# EAGLE design SparkFun_Thing_Plus_NORA_W306 (EAGLE 9.6.2)
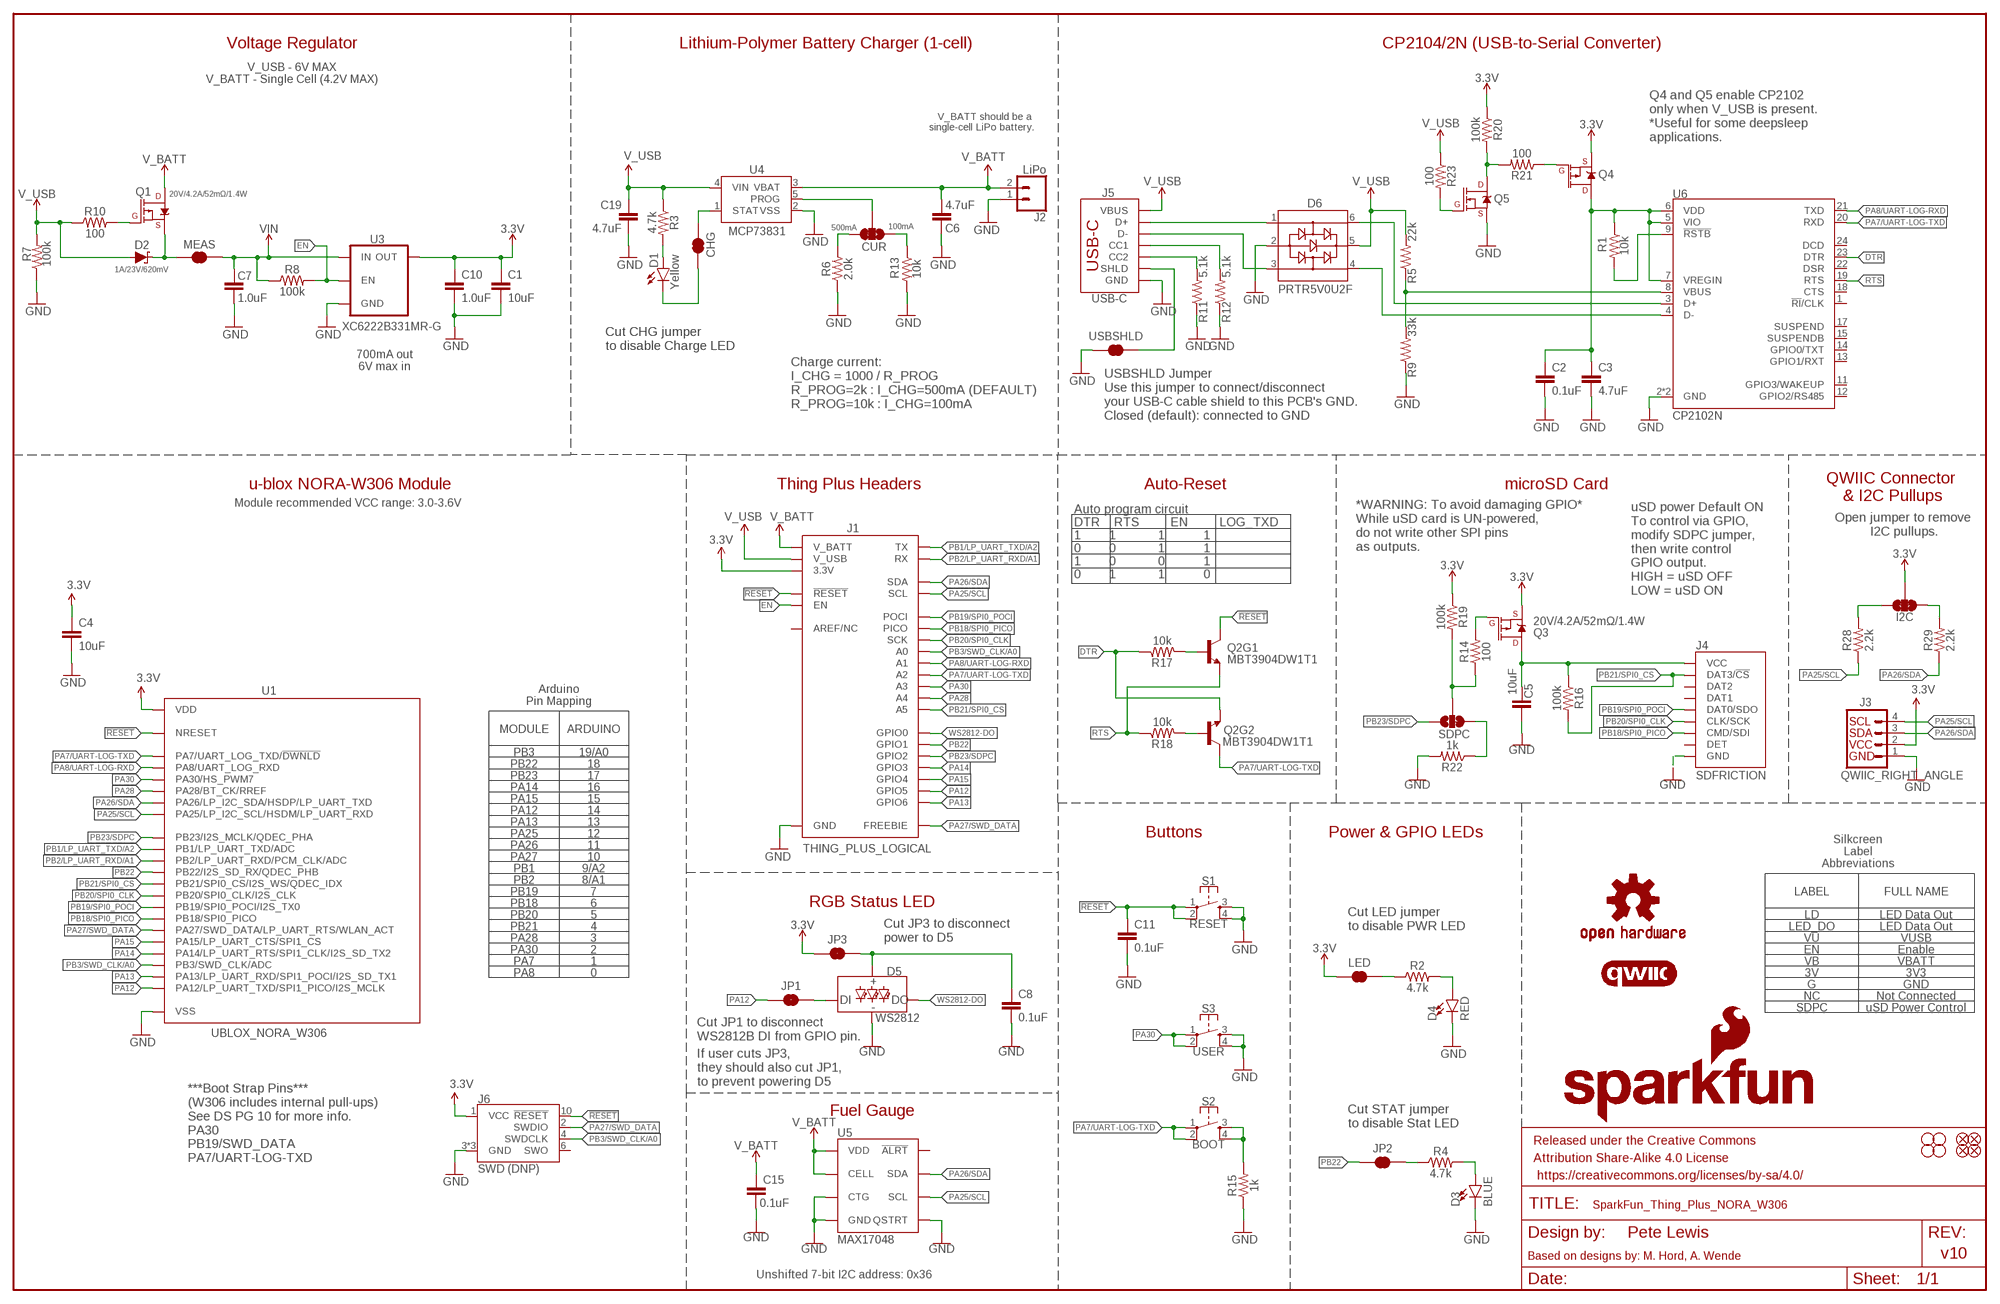
[diagram p0: schematic, sheet 1]

## Parts
C1  10uF  10UF-0402T-6.3V-20%  [0402-TIGHT]
C2  0.1uF  0.1UF-0402T-16V-10%  [0402-TIGHT]
C3  4.7uF  4.7UF-0603-35V-(20%)  [0603]
C4  10uF  10UF-0402T-6.3V-20%  [0402-TIGHT]
C5  10uF  10UF-0402T-6.3V-20%  [0402-TIGHT]
C6  4.7uF  4.7UF-0603-35V-(20%)  [0603]
C7  1.0uF  1.0UF-0402T-16V-10%  [0402-TIGHT]
C8  0.1uF  0.1UF-0402T-16V-10%  [0402-TIGHT]
C10  1.0uF  1.0UF-0402T-16V-10%  [0402-TIGHT]
C11  0.1uF  0.1UF-0402T-16V-10%  [0402-TIGHT]
C15  0.1uF  0.1UF-0402T-16V-10%  [0402-TIGHT]
C19  4.7uF  4.7UF-0603-35V-(20%)  [0603]
CHG  JUMPER-SMT_2_NC_TRACE_SILK  [SMT-JUMPER_2_NC_TRACE_SILK]
CUR  JUMPER-SMT_3_1-NC_TRACE_SILK  [SMT-JUMPER_3_1-NC_TRACE_SILK]
D1  Yellow  LED-YELLOW0603  [LED-0603]
D2  1A/23V/620mV  DIODE-SCHOTTKY-BAT20J  [SOD-323]
D3  BLUE  LED-BLUE0603  [LED-0603]
D4  RED  LED-RED_0603-KB  [LED-0603]
D5  WS2812  WS2812_2020  [WS2812-2020]
D6  PRTR5V0U2F  [SOT886]
FD1  FIDUCIALUFIDUCIAL  [FIDUCIAL-MICRO]
FD2  FIDUCIALUFIDUCIAL  [FIDUCIAL-MICRO]
FD3  FIDUCIALUFIDUCIAL  [FIDUCIAL-MICRO]
FD4  FIDUCIALUFIDUCIAL  [FIDUCIAL-MICRO]
FRAME1  FRAME-LEDGER  [CREATIVE_COMMONS]
H1  STAND-OFF  [STAND-OFF]
H2  STAND-OFF  [STAND-OFF]
H3  STAND-OFF  [STAND-OFF]
H4  STAND-OFF  [STAND-OFF]
I2C  JUMPER-SMT_3_2-NC_TRACE_SILK  [SMT-JUMPER_3_2-NC_TRACE_SILK]
J1  THING_PLUS_LOGICAL  [THING_PLUS]
J2  LiPo  CONN_02-JST-2MM-SMT  [JST-2-SMD]
J3  QWIIC_RIGHT_ANGLE  QWIIC_CONNECTORJS-1MM  [JST04_1MM_RA]
J4  SDFRICTION  MICRO-SDFRICTION  [MICROSD_TINY]
J5  USB-C  USB_C_4-LAYER-ISOLATED  [USB-C-16P-4LAYER-ISOLATED]
J6  SWD (DNP)  CORTEX_JTAG_DEBUG_MINIMUM_SMD_UNSHROUDED_DNP_NO_PASTE  [2X5-SMD-UNSHROUDED_DNP_NO_PASTE]
JP1  JUMPER-SMT_2_NC_TRACE_SILK  [SMT-JUMPER_2_NC_TRACE_SILK]
JP2  JUMPER-SMT_2_NC_TRACE_SILK  [SMT-JUMPER_2_NC_TRACE_SILK]
JP3  JUMPER-SMT_2_NC_TRACE_SILK  [SMT-JUMPER_2_NC_TRACE_SILK]
LED  JUMPER-SMT_2_NC_TRACE_SILK  [SMT-JUMPER_2_NC_TRACE_SILK]
LOGO2  OSHW-LOGOM  [OSHW-LOGO-M]
LOGO3  SFE_LOGO_NAME_FLAME.1_INCH  [SFE_LOGO_NAME_FLAME_.1]
LOGO6  QWIIC_LOGO_4MM  [QWIIC_4MM]
MEAS  JUMPER-COMBO_2_NC_TRACE  [COMBO-JUMPER_2_NC_TRACE]
Q1  20V/4.2A/52mΩ/1.4W  MOSFET_PCH-DMG2305UX-7  [SOT23-3]
Q2  MBT3904DW1T1  TRANS_NPN_DUAL-MBT3904DW1T1  [SC70-6]
Q3  20V/4.2A/52mΩ/1.4W  MOSFET_PCH-DMG2305UX-7  [SOT23-3]
Q4  20V/4.2A/52mΩ/1.4W  MOSFET_PCH-DMG2305UX-7  [SOT23-3]
Q5  20V/0.2A/8MHz/1.2Ω/1Vth  MOSFET-NCH-RE1C002UNTCL  [SOT-416FL]
R1  10k  10KOHM-0402T-1/16W-1%  [0402-TIGHT]
R2  4.7k  4.7KOHM-0402T-1/16W-1%  [0402-TIGHT]
R3  4.7k  4.7KOHM-0402T-1/16W-1%  [0402-TIGHT]
R4  4.7k  4.7KOHM-0402T-1/16W-1%  [0402-TIGHT]
R5  22k  22KOHM-0402_TIGHT-1/10W-1%  [0402-TIGHT]
R6  2.0k  2.0KOHM-0603-1/10W-5%  [0603]
R7  100k  100KOHM-0402T-1/16W-1%  [0402-TIGHT]
R8  100k  100KOHM-0402T-1/16W-1%  [0402-TIGHT]
R9  33k  33KOHM-0402T-1/16W-1%  [0402-TIGHT]
R10  100  100OHM-0402-TIGHT-1/16W-1%  [0402-TIGHT]
R11  5.1k  5.1KOHM-0402T-1/16W-1%  [0402-TIGHT]
R12  5.1k  5.1KOHM-0402T-1/16W-1%  [0402-TIGHT]
R13  10k  10KOHM-0402T-1/16W-1%  [0402-TIGHT]
R14  100  100OHM-0402-TIGHT-1/16W-1%  [0402-TIGHT]
R15  1k  1KOHM-0402T-1/16W-1%  [0402-TIGHT]
R16  100k  100KOHM-0402T-1/16W-1%  [0402-TIGHT]
R17  10k  10KOHM-0402T-1/16W-1%  [0402-TIGHT]
R18  10k  10KOHM-0402T-1/16W-1%  [0402-TIGHT]
R19  100k  100KOHM-0402T-1/16W-1%  [0402-TIGHT]
R20  100k  100KOHM-0402T-1/16W-1%  [0402-TIGHT]
R21  100  100OHM-0402-TIGHT-1/16W-1%  [0402-TIGHT]
R22  1k  1KOHM-0402T-1/16W-1%  [0402-TIGHT]
R23  100  100OHM-0402-TIGHT-1/16W-1%  [0402-TIGHT]
R28  2.2k  2.2KOHM-0402T-1/16W-1%  [0402-TIGHT]
R29  2.2k  2.2KOHM-0402T-1/16W-1%  [0402-TIGHT]
S1  RESET  MOMENTARY-SWITCH-SPST-2-SMD-4.6X2.8MM  [TACTILE_SWITCH_SMD_4.6X2.8MM]
S2  BOOT  MOMENTARY-SWITCH-SPST-2-SMD-4.6X2.8MM  [TACTILE_SWITCH_SMD_4.6X2.8MM]
S3  USER  MOMENTARY-SWITCH-SPST-2-SMD-4.6X2.8MM  [TACTILE_SWITCH_SMD_4.6X2.8MM]
SDPC  JUMPER-SMT_3_1-NC_TRACE_SILK  [SMT-JUMPER_3_1-NC_TRACE_SILK]
U1  UBLOX_NORA_W306  [UBLOX-NORA-W3]
U3  XC6222B331MR-G  [SOT23-5]
U4  MCP73831  [SOT23-5]
U5  MAX17048  MAX17048DFN8  [DFN-8]
U6  CP2102N  [QFN24]
USBSHLD  JUMPER-SMT_2_NC_TRACE_SILK  [SMT-JUMPER_2_NC_TRACE_SILK]

## Nets
3.3V: C1.1 C4.1 C10.1 I2C.2 J1.27(3.3V) J3.2 J6.1(VCC) JP3.1 LED.1 Q3.2(S) Q4.2(S) R19.1 R20.1 U1.A7(VDD) U1.A8(VDD) U1.B7(VDD) U3.5(OUT)
!RESET!: C11.1 J1.28(!RESET) J6.10(!RESET) Q2.3(C) S1.1 S1.2 U1.J3(NRESET)
CC1: J5.A5(CC1) R12.2
CC2: J5.B5(CC2) R11.2
CHG: CHG.2 U4.1(STAT)
DTR: Q2.1(E) R17.1 U6.23(DTR)
EN: J1.11(EN) R8.2 U3.3(EN)
GND: C1.2 C2.2 C3.2 C4.2 C5.2 C6.2 C7.2 C8.2 C10.2 C11.2 C15.2 C19.2 D3.C D4.C D5.GND D6.2 J1.25(GND) J2.1 J3.1 J4.6(GND) J4.GND1(GND) J4.GND2(GND) J4.GND3(GND) J4.GND4(GND) J4.GND5(GND) J4.GND6(GND) J5.GND J5.GND2(GND) J6.3(GND) J6.5(GND) J6.9(GND) Q5.2(S) R6.1 R7.1 R9.1 R11.1 R12.1 R13.2 R15.1 R22.2 S1.3 S1.4 S3.3 S3.4 U1.A1(VSS) U1.A9(VSS) U1.B2(VSS) U1.B8(VSS) U1.E4(VSS) U1.E5(VSS) U1.F4(VSS) U1.F5(VSS) U1.K2(VSS) U1.K3(VSS) U1.K5(VSS) U1.K7(VSS) U1.K8(VSS) U1.L1(VSS) U1.L9(VSS) U1.M1(VSS) U1.M2(VSS) U1.M8(VSS) U1.M9(VSS) U3.2(GND) U4.2(VSS) U5.1(CTG) U5.4(GND) U5.6(QSTRT) U5.9(GND) U6.2(GND) U6.PAD(GND) USBSHLD.1
N$1: R1.2 U6.9(!RSTB)
N$2: D3.A R4.2
N$3: Q2.5(B) R17.2
N$4: R5.1 R9.2 U6.8(VBUS)
N$5: Q2.2(B) R18.2
N$6: CHG.1 D1.C
N$7: Q1.1(G) R10.2
N$8: R15.2 S2.3 S2.4
N$9: CUR.2 U4.5(PROG)
N$10: D5.DI JP1.2
N$11: CUR.1 R13.1
N$12: LED.2 R2.1
N$13: CUR.3 R6.2
N$14: D4.A R2.2
N$15: D6.6 U6.3(D+)
N$16: D6.1 J5.A6(D+) J5.B6(D+)
N$17: D1.A R3.2
N$18: D6.4 U6.4(D-)
N$19: D6.3 J5.A7(D-) J5.B7(D-)
N$20: I2C.3 R28.2
N$21: I2C.1 R29.2
N$22: JP2.2 R4.1
N$23: D2.C MEAS.1 MEAS.3 Q1.2(S)
N$24: Q3.1(G) R14.2
N$25: C5.1 J4.4(VCC) Q3.3(D) R16.1
N$26: R14.1 R19.2 SDPC.2
N$27: Q5.3(D) R20.2 R21.2
N$28: C8.1 D5.VCC JP3.2
N$29: C2.1 C3.1 Q4.3(D) R1.1 U6.5(VIO) U6.6(VDD) U6.7(VREGIN)
N$30: Q4.1(G) R21.1
N$31: Q5.1(G) R23.2
N$32: R22.1 SDPC.3
PA7/UART-LOG-TXD: J1.22(A2) Q2.6(C) S2.1 S2.2 U1.A5(PA7/UART_LOG_TXD/!DWNLD!) U6.20(RXD)
PA8/UART-LOG-RXD: J1.23(A1) U1.A6(PA8/UART_LOG_RXD) U6.21(TXD)
PA12: J1.4(GPIO5) JP1.1 U1.J9(PA12/LP_UART_TXD/SPI1_PICO/I2S_MCLK)
PA13: J1.3(GPIO6) U1.J8(PA13/LP_UART_RXD/SPI1_POCI/I2S_SD_TX1)
PA14: J1.6(GPIO3) U1.H9(PA14/LP_UART_RTS/SPI1_CLK/I2S_SD_TX2)
PA15: J1.5(GPIO4) U1.H8(PA15/LP_UART_CTS/SPI1_CS)
PA25/SCL: J1.2(SCL) J3.4 R28.1 U1.C2(PA25/LP_I2C_SCL/HSDM/LP_UART_RXD) U5.7(SCL)
PA26/SDA: J1.1(SDA) J3.3 R29.1 U1.C1(PA26/LP_I2C_SDA/HSDP/LP_UART_TXD) U5.8(SDA)
PA27/SWD_DATA: J1.13(FREEBIE) J6.2(SWDIO) U1.H2(PA27/SWD_DATA/LP_UART_RTS/WLAN_ACT)
PA28: J1.20(A4) U1.B3(PA28/BT_CK/RREF)
PA30: J1.21(A3) S3.1 S3.2 U1.B1(PA30/HS_PWM7)
PB1/LP_UART_TXD/A2: J1.14(TX) U1.D8(PB1/LP_UART_TXD/ADC)
PB2/LP_UART_RXD/A1: J1.15(RX) U1.E8(PB2/LP_UART_RXD/PCM_CLK/ADC)
PB3/SWD_CLK/A0: J1.24(A0) J6.4(SWDCLK) U1.J2(PB3/SWD_CLK/ADC)
PB18/SPI0_PICO: J1.17(PICO) J4.3(CMD/SDI) U1.G9(PB18/SPI0_PICO)
PB19/SPI0_POCI: J1.16(POCI) J4.7(DAT0/SDO) U1.G8(PB19/SPI0_POCI/I2S_TX0)
PB20/SPI0_CLK: J1.18(SCK) J4.5(CLK/SCK) U1.F9(PB20/SPI0_CLK/I2S_CLK)
PB21/SPI0_CS: J1.19(A5) J4.2(DAT3/!CS!) R16.2 U1.F8(PB21/SPI0_CS/I2S_WS/QDEC_IDX)
PB22: J1.8(GPIO1) JP2.1 U1.E9(PB22/I2S_SD_RX/QDEC_PHB)
PB23/SDPC: J1.7(GPIO2) SDPC.1 U1.C8(PB23/I2S_MCLK/QDEC_PHA)
RTS: Q2.4(E) R18.1 U6.19(RTS)
USB_SHLD: J5.SHLD1(SHLD) J5.SHLD2(SHLD) J5.SHLD3(SHLD) J5.SHLD4(SHLD) J5.SHLD5(SHLD) J5.SHLD6(SHLD) J5.SHLD7(SHLD) J5.SHLD8(SHLD) USBSHLD.2
V_BATT: C6.1 C15.1 J1.12(V_BATT) J2.2 Q1.3(D) U4.3(VBAT) U5.2(CELL) U5.3(VDD)
V_USB: C19.1 D2.A D6.5 J1.10(V_USB) J5.VBUS1(VBUS) J5.VBUS2(VBUS) R3.1 R5.2 R7.2 R10.1 R23.1 U4.4(VIN)
VIN: C7.1 MEAS.2 MEAS.4 R8.1 U3.1(IN)
WS2812-DO: D5.DO J1.9(GPIO0)
Unconnected: J1.26(AREF/NC) J4.1(DAT2) J4.8(DAT1) J4.9(DET) J6.6(SWO) U5.5(!ALRT) U6.1(!RI!/CLK) U6.11(GPIO3/WAKEUP) U6.12(GPIO2/RS485) U6.13(GPIO1/RXT) U6.14(GPIO0/TXT) U6.15(SUSPENDB) U6.17(SUSPEND) U6.18(CTS) U6.22(DSR) U6.24(DCD)

## Notes on the sheet
- Voltage Regulator | Lithium-Polymer Battery Charger (1-cell) | CP2104/2N (USB-to-Serial Converter)
- V_USB - 6V MAX
  V_BATT - Single Cell (4.2V MAX)
- V_BATT should be a 
  single-cell LiPo battery.
- Q4 and Q5 enable CP2102
  only when V_USB is present.
  *Useful for some deepsleep 
  applications.
- 500mA | 100mA
- 700mA out
  6V max in
- Cut CHG jumper 
  to disable Charge LED
- Charge current:
  I_CHG = 1000 / R_PROG
  R_PROG=2k : I_CHG=500mA (DEFAULT)
  R_PROG=10k : I_CHG=100mA
- USBSHLD Jumper
  Use this jumper to connect/disconnect
  your USB-C cable shield to this PCB's GND.
  Closed (default): connected to GND
- u-blox NORA-W306 Module | Thing Plus Headers | Auto-Reset | microSD Card
- QWIIC Connector 
  & I2C Pullups
- Module recommended VCC range: 3.0-3.6V
- *WARNING: To avoid damaging GPIO*
  While uSD card is UN-powered,
  do not write other SPI pins
  as outputs.
- Open jumper to remove 
  I2C pullups.
- uSD power Default ON
  To control via GPIO, 
  modify SDPC jumper,
  then write control 
  GPIO output.
  HIGH = uSD OFF
  LOW = uSD ON
- Auto program circuit
  DTR    RTS         EN         LOG_TXD
  1        1            1           1
  0        0            1           1
  1        0            0           1
  0        1            1           0
- Arduino
  Pin Mapping
- MODULE | ARDUINO
- PB3 | 19/A0
- PB22 | 18
- PB23 | 17
- PA14 | 16
- PA15 | 15
- PA12 | 14
- PA13 | 13
- PA25 | 12 | Buttons | Power & GPIO LEDs
- PA26 | 11
- PA27 | 10
- Silkcreen
  Label
  Abbreviations
- PB1 | 9/A2
- PB2 | 8/A1
- PB19 | 7 | LABEL | FULL NAME
- PB18 | 6 | RGB Status LED
- PB20 | 5 | LD | LED Data Out
- PB21 | 4
- Cut LED jumper 
  to disable PWR LED
- LED_DO | LED Data Out
- PA28 | 3
- Cut JP3 to disconnect
  power to D5
- VU | VUSB
- PA30 | 2 | EN | Enable
- PA7 | 1 | VB | VBATT
- PA8 | 0 | 3V | 3V3
- G | GND
- NC | Not Connected
- SDPC | uSD Power Control
- Cut JP1 to disconnect
  WS2812B DI from GPIO pin.
- If user cuts JP3,
  they should also cut JP1,
  to prevent powering D5
- Fuel Gauge
- Cut STAT jumper 
  to disable Stat LED
- ***Boot Strap Pins***
  (W306 includes internal pull-ups)
  See DS PG 10 for more info.
  PA30
  PB19/SWD_DATA
  PA7/UART-LOG-TXD
- Pete Lewis
- v10
- Based on designs by: M. Hord, A. Wende
- Unshifted 7-bit I2C address: 0x36

## Library data of the parts
C1 C4 C5 = SparkFun-Capacitors:10UF: 10.0µF ceramic capacitors A capacitor is a passive two-terminal electrical component used to store electrical energy temporarily in an electric field.; PROD_ID: CAP-14848
C2 C8 C11 C15 = SparkFun-Capacitors:0.1UF: 0.1µF ceramic capacitors A capacitor is a passive two-terminal electrical component used to store electrical energy temporarily in an electric field.; PROD_ID: CAP-12416
C3 C6 C19 = SparkFun-Capacitors:4.7UF: 4.7µF ceramic capacitors A capacitor is a passive two-terminal electrical component used to store electrical energy temporarily in an electric field.; PROD_ID: CAP-14106
C7 C10 = SparkFun-Capacitors:1.0UF: 1µF ceramic capacitors A capacitor is a passive two-terminal electrical component used to store electrical energy temporarily in an electric field.; PROD_ID: CAP-12417
CHG JP1-JP3 LED USBSHLD = SparkFun-Jumpers:JUMPER-SMT_2_NC_TRACE: Normally closed trace jumper This jumper has a trace between two pads so it's normally closed (NC). Use a razor knife to open the connection. For best results follow the IPC guidelines for cutting traces: Cutout at least 0.063 mm (0.005 in). Remove all loose material to clean up the cut area. Seal the cut with an approved epoxy. Reapply solder to reclose the connection.
CUR SDPC = SparkFun-Jumpers:JUMPER-SMT_3_1-NC_TRACE: Normally closed trace jumper (1 of 2 connections) This jumper has a trace between two pads so it's normally closed (NC). The other connection is normally open (NO). Use a razor knife to open the connection. For best results follow the IPC guidelines for cutting traces: Cutout at least 0.063 mm (0.005 in). Remove all loose material to clean up the cut area. Seal the cut with an approved epoxy. Reapply solder to reclose the connection, or to close the NO connection.
D1 = SparkFun-LED:LED-YELLOW: Yellow SMD LED Used in manufacturing several products at SparkFun. Packages: 0603 - SMD 0603 package[Product Link] <http://www.kingbrightusa.com/product.asp?catalog_name=LED&product_id=APT1608SYCK> 0603 -SMART - SMART SMD 0603 package (more efficient/more expensive) [Product Link] <http://www.osram-os.com/osram_os/en/products/product-catalog/led-light-emitting-diodes/smartled-0603/ly-l29k/index.jsp> LilyPad - SMD1206 package[Product Datasheet] <https://www.sparkfun.com/datasheets/DevTools/LilyPad/Q150YUS4.pdf> SparkFun Products: Blynk Board <https://www.sparkfun.com/products/13794> IOIO-OTG <https://www.sparkfun.com/products/13613> XBee Explorer Serial <https://www.sparkfun.com/products/13225>; PROD_ID: DIO-09003
D2 = SparkFun-DiscreteSemi:DIODE-SCHOTTKY: Schottky diode A Schottky diode is a semiconductor diode which has a low forward voltage drop and a very fast switching action.; PROD_ID: DIO-11623
D3 = SparkFun-LED:LED-BLUE: Blue SMD LED Used in manufacturing of various products at SparkFun Packages: 0603 - SMD 0603 package [Product Link] <http://www.digikey.com/product-detail/en/SMLE12BC7TT86/511-1589-2-ND/1641808> 1206 - SMD1206 package [Product Link] <http://www.digikey.com/product-detail/en/lite-on-inc/LTST-C150TBKT/160-1643-1-ND/573584> SparkFun Products: ESP8266 Thing-Dev Board <https://www.sparkfun.com/products/13711> RedBoard <https://www.sparkfun.com/products/12757>; PROD_ID: DIO-08575
D4 = SparkFun-LED:LED-RED: Red SMD LED Used in manufacturing of most products at SparkFun Packages: 0603 - KB - KingBright (DIO-17976) SMD 0603 package [Datasheet] <https://www.kingbrightusa.com/images/catalog/SPEC/APT1608SURCK.pdf> 0603 - (DIO-00819, has gone EOL) SMD 0603 package 0603 SMART - SMD 0603 SMART package ( more efficient and expensive)[Product Link] <http://www.osram-os.com/Graphics/XPic2/00077099_0.pdf> 1206 - SMD1206 package [Product Link] <https://www.sparkfun.com/datasheets/DevTools/LilyPad/Q150OVS4.pdff> SparkFun Products: Pro Mini 328 -5V <https://www.sparkfun.com/products/821> RedBoard <https://www.sparkfun.com/products/12757> IOIO-OTG <https://www.sparkfun.com/products/13613>; PROD_ID: DIO-17976
D5 = SparkFun-LED:WS2812: Addressable RGB LED - 1 Wire Common names: WS2812, SK6812, Neopixel, APA-106, etc. SMD LED with built-in controller IC. Color: Red/Green/Blue SparkFun Products: LED-SMD RGB (WS2812) <https://www.sparkfun.com/products/11821> LED - RGB Addressable, PTH, 5mm Diffused (5 Pack) <https://www.sparkfun.com/products/12986> LED - RGB Addressable, PTH, 5mm Clear (5 Pack) <https://www.sparkfun.com/products/12999> Blynk Board - ESP8266 <https://www.sparkfun.com/products/13794> Datasheet referenced for footprint: WS2812B-PTH <https://cdn.sparkfun.com/datasheets/Components/LED/COM-12877.pdf>; PROD_ID: DIO-15591
D6 = SparkFun-IC-Power:PRTR5V0U2: A small ESD protection device. Most commonly used on USB D+/D- signals to protect large, expensive, or especially sensitive USB enabled devices.; PROD_ID: DIO-14084
FD1-FD4 = SparkFun-Aesthetics:FIDUCIAL: Fiducial Alignment Points Point-of-reference for pick-and-place machines and other optical instruments.
FRAME1 = SparkFun-Aesthetics:FRAME-LEDGER: Schematic Frame - Ledger Standard 11x14 US Ledger frame
H1-H4 = SparkFun-Hardware:STAND-OFF: Stand Off Drill holes for mechanically mounting via screws, standoffs, etc. Note: Use the keepout ring to avoid running the screw head into surrounding components. Variant Overviews STAND-OFF - Mechanical footprint for a #4 phillips button head screw. STAND-OFF-TIGHT - Mechanical footprint for a #4 phillips button head screw, Example SparkFun Products Screw - Phillips Head (1/4", 4-40, 10 pack) <https://www.sparkfun.com/products/10453> (PRT-10453) Screw - Phillips Head (1/2", 4-40, 10 pack) <https://www.sparkfun.com/products/10452> (PRT-10452) Screw - Phillips Head (3/4", 4-40, 10 pack) <https://www.sparkfun.com/products/10451> (PRT-10451) Screw - Phillips Head (1", 4-40, 10 pack) <https://www.sparkfun.com/products/10450> (PRT-10450)
I2C = SparkFun-Jumpers:JUMPER-SMT_3_2-NC_TRACE: Normally closed trace jumper (2 of 2 connections) This jumper has a trace between all three pads so they are normally closed (NC). Use a razor knife to open the connection(s). For best results follow the IPC guidelines for cutting traces: Cutout at least 0.063 mm (0.005 in). Remove all loose material to clean up the cut area. Seal the cut with an approved epoxy. Reapply solder to reclose the connection(s).
J1 = SparkFun-Boards:THING_PLUS_LOGICAL
J2 = SparkFun-Connectors:CONN_02: Multi connection point. Often used as Generic Header-pin footprint for 0.1 inch spaced/style header connections On any of the 0.1 inch spaced packages, you can populate with these: Break Away Headers - Straight <https://www.sparkfun.com/products/116> (PRT-00116) Break Away Male Headers - Right Angle <https://www.sparkfun.com/products/553> (PRT-00553) Female Headers <https://www.sparkfun.com/products/115> (PRT-00115) Break Away Headers - Machine Pin <https://www.sparkfun.com/products/117> (PRT-00117) Break Away Female Headers - Swiss Machine Pin <https://www.sparkfun.com/products/743> (PRT-00743) For SCREWTERMINALS and SPRING TERMINALS visit here: Screw Terimnals on SparkFun.com <https://www.sparkfun.com/search/results?term=Screw+Terminals> (5mm/3.5mm/2.54mm spacing) This device is also useful as a general connection point to wire up your design to another part of your project. Our various solder wires solder well into these plated through hole pads. Hook-Up Wire - Assortment (Stranded, 22 AWG) <https://www.sparkfun.com/products/11375> (PRT-11375) Hook-Up Wire - Assortment (Solid Core, 22 AWG) <https://www.sparkfun.com/products/11367> (PRT-11367) View the entire wire category on our website here <https://www.sparkfun.com/categories/141> Special notes: Molex polarized connector foot print use with: PRT-08233 with associated crimp pins and housings. 2.54_SCREWTERM for use with PRT-10571. 3.5mm Screw Terminal footprints for PRT-08084 5mm Screw Terminal footprints for use with PRT-08432; PROD_ID: CONN-11443
J3 = SparkFun-Connectors:QWIIC_CONNECTOR: SparkFun I2C Standard Qwiic Connector An SMD 1mm pitch JST connector makes it easy and quick (get it? Qwiic?) to connect I2C devices to each other. The Qwiic system <http://www.sparkfun.com/qwiic> enables fast and solderless connection between popular platforms and various sensors and actuators. We carry 200mm <https://www.sparkfun.com/products/14204>, 100mm <https://www.sparkfun.com/products/14205>, 50mm <https://www.sparkfun.com/products/14206>, and breadboard friendly <https://www.sparkfun.com/products/14207> Qwiic cables. We also offer 10 pcs strips <https://www.sparkfun.com/products/14323> the SMD connectors.; PROD_ID: CONN-13694
J4 = SparkFun-Connectors:MICRO-SD: microSD Socket for Transflash Various sockets for µSD. tDoc lines correctly indicate media card edge positions when inserting (unlocked, locked, depressed). NOTE: CD1 and CD2 are connected internally, and the default detect state of the socket is detect pin to ground. SparkFun Products: WAV Trigger <https://www.sparkfun.com/products/13660> CAN-Bus Shield <https://www.sparkfun.com/products/13262> SparkFun Level Shifing microSD Breakout <https://www.sparkfun.com/products/13743>; PROD_ID: CONN-13500
J5 = SparkFun-Connectors:USB_C: USB Type C 16Pin Connector Super Speed pins not available on the 16-pin purely SMD connector so this part is best for USB 2.0 implementations. D1 and D2 are tied together enabling D+/- no matter which way the cable is plugged into the connector. The two channel configuration pins (CC1/2) are exposed. These are normally connected to ground via 5.1k resistors but can be reconfigured for high current/high power applications. **4-LAYER BOARD WARNING!!** If designing 4-layer board, make sure to select the variant _4-LAYER-ISOLATED. The linked footprint (USB-C-16-4LAYER-ISOLATED) includes some very necessary cutout polygons in the inner layers (2 and 15). This prevents the PTH mounting shield legs on the USB connector from electrically connecting any other polygons on the inner layers (usually VCC and GND).; PROD_ID: CONN-14122; VALUE: USB Female Type C Connector
J6 = SparkFun-Connectors:CORTEX_JTAG_DEBUG_MINIMUM: Cortex Debug Connector - 10 pin Supports JTAG debug, Serial Wire debug, and Serial Wire Viewer. PTH and SMD connector options available. General Connector Information <http://infocenter.arm.com/help/topic/com.arm.doc.faqs/attached/13634/cortex_debug_connectors.pdf> Products: PTH Connector <http://www.digikey.com/product-detail/en/cnc-tech/3220-10-0100-00/1175-1627-ND/3883661> -via Digi-Key SparkFun PSoc <https://www.sparkfun.com/products/13229> SparkFun T <https://www.sparkfun.com/products/13810>
LOGO2 = SparkFun-Aesthetics:OSHW-LOGO: Open-Source Hardware (OSHW) Logo This logo indicates the piece of hardware it is found on incorporates a OSHW license and/or adheres to the definition of open source hardware found here: http://freedomdefined.org/OSHW
LOGO3 = SparkFun-Aesthetics:SFE_LOGO_NAME_FLAME: SparkFun Font Logo w/ Flame This is the SparkFun full logo. The logo on the schematic will always be the same size; the package variant is the height of the flame part of the logo. Default layer for the logo on the board is tSilk.
LOGO6 = SparkFun-Aesthetics:QWIIC_LOGO: Qwiic Logos for placement on schematic and PCB. The 5.5mm silk logo is best for placing next to Qwiic connector.
MEAS = SparkFun-Jumpers:JUMPER-COMBO_2_NC_TRACE
Q1 Q3 Q4 = SparkFun-DiscreteSemi:MOSFET_PCH: P-channel MOSFETs Voltage controlled devices that allow control of high current outputs. SparkFun Products: SparkFun ESP32 Thing <https://www.sparkfun.com/products/13907> SparkFun ESP8266 Thing <https://www.sparkfun.com/products/13231> SparkFun Pi Servo HAT V2 <https://www.sparkfun.com/products/15316> DMG2305UX-7 (20V/4.2A/SOT23-3); PROD_ID: TRANS-14388
Q2 = SparkFun-DiscreteSemi:TRANS_NPN_DUAL: Dual NPN Transistors in Single Package The MBT3904W1 puts two general purpose 3904 NPN transistors in a single package. Datasheet <http://www.onsemi.com/pub_link/Collateral/MBT3904DW1T1-D.PDF> SparkFun Products: SparkFun ESP32 Thing <https://www.sparkfun.com/products/13907>; PROD_ID: TRANS-13337
Q5 = SparkFun-DiscreteSemi:MOSFET-NCH: N-channel MOSFETs Voltage controlled devices that allow control of high current outputs. SparkFun Products: SparkFun OpenScale <https://www.sparkfun.com/products/13261> SparkFun Digital Sandbox <https://www.sparkfun.com/products/12651> SparkFun Monster Moto Shield <https://www.sparkfun.com/products/10182> SparkFun MOSFET Power Controller <https://www.sparkfun.com/products/11214>; PROD_ID: TRANS-14399
R1 R13 R17 R18 = SparkFun-Resistors:10KOHM: 10kΩ resistor A resistor is a passive two-terminal electrical component that implements electrical resistance as a circuit element. Resistors act to reduce current flow, and, at the same time, act to lower voltage levels within circuits. - Wikipedia; PROD_ID: RES-14241
R2-R4 = SparkFun-Resistors:4.7KOHM: 4.7kΩ resistor A resistor is a passive two-terminal electrical component that implements electrical resistance as a circuit element. Resistors act to reduce current flow, and, at the same time, act to lower voltage levels within circuits. - Wikipedia; PROD_ID: RES-15343
R5 = SparkFun-Resistors:22KOHM: 22kΩ resistor A resistor is a passive two-terminal electrical component that implements electrical resistance as a circuit element. Resistors act to reduce current flow, and, at the same time, act to lower voltage levels within circuits. - Wikipedia; PROD_ID: RES-14281
R6 = SparkFun-Resistors:2.0KOHM: 2kΩ resistor A resistor is a passive two-terminal electrical component that implements electrical resistance as a circuit element. Resistors act to reduce current flow, and, at the same time, act to lower voltage levels within circuits. - Wikipedia; PROD_ID: RES-08296
R7 R8 R16 R19 R20 = SparkFun-Resistors:100KOHM: 100kΩ resistor A resistor is a passive two-terminal electrical component that implements electrical resistance as a circuit element. Resistors act to reduce current flow, and, at the same time, act to lower voltage levels within circuits. - Wikipedia; PROD_ID: RES-13495
R9 = SparkFun-Resistors:33KOHM: 33kΩ resistor A resistor is a passive two-terminal electrical component that implements electrical resistance as a circuit element. Resistors act to reduce current flow, and, at the same time, act to lower voltage levels within circuits. - Wikipedia; PROD_ID: RES-15128
R10 R14 R21 R23 = SparkFun-Resistors:100OHM: 100Ω resistor A resistor is a passive two-terminal electrical component that implements electrical resistance as a circuit element. Resistors act to reduce current flow, and, at the same time, act to lower voltage levels within circuits. - Wikipedia; PROD_ID: RES-14962
R11 R12 = SparkFun-Resistors:5.1KOHM; PROD_ID: RES-14340
R15 R22 = SparkFun-Resistors:1KOHM: 1kΩ resistor A resistor is a passive two-terminal electrical component that implements electrical resistance as a circuit element. Resistors act to reduce current flow, and, at the same time, act to lower voltage levels within circuits. - Wikipedia; PROD_ID: RES-14342
R28 R29 = SparkFun-Resistors:2.2KOHM: 2.2kΩ resistor A resistor is a passive two-terminal electrical component that implements electrical resistance as a circuit element. Resistors act to reduce current flow, and, at the same time, act to lower voltage levels within circuits. - Wikipedia; PROD_ID: RES-14341
S1-S3 = SparkFun-Switches:MOMENTARY-SWITCH-SPST-2: Momentary Switch (Pushbutton) - SPST - Two Circuits Normally-open (NO) SPST momentary switches (buttons, pushbuttons). Schematic symbol includes two switch circuits. Variants SMD-4.6MMX2.8MM - 4.60mm x 2.80mm Tactile Momentary Button Switch - Used on SparkFun Pro Micro - RP2040 <https://www.sparkfun.com/products/17717> SMD-5.2MM - Mini Pushbutton Switch - SMD <https://www.sparkfun.com/products/8720> - Used on Arduino Pro Mini <https://www.sparkfun.com/products/11114>; PROD_ID: SWCH-15606
U1 = nora-w306:UBLOX_NORA_W306; PROD_ID: IC-17585
U3 = SparkFun-IC-Power:XC6222; IOUT: 700mA; PROD_ID: VREG-16775; VOUT: 3.3V
U4 = SparkFun-IC-Power:MCP73831: MCP73831T Li-Ion, Li-Pol Controller Miniature single cell, fully integrated Li-Ion, Li-polymer charge management controller Datasheet <http://ww1.microchip.com/downloads/en/DeviceDoc/20001984g.pdf> SparkFun Products: SparkFun ESP32 Thing <https://www.sparkfun.com/products/13907> SparkFun 9DoF Razor IMU M0 <https://www.sparkfun.com/products/14001>; PROD_ID: IC-09995
U5 = SparkFun-IC-Power:MAX17048: Micropower 1-Cell Li+ ModelGauge SparkFun Products Qduino Mini <https://www.sparkfun.com/products/13614> (DEV-13614); PROD_ID: IC-12551
U6 = SparkFun-IC-Comms:CP2102N; PROD_ID: IC-14020

## Net classes
0 default: width 0 mm, drill 0 mm
1 POWER: width 0.559 mm, drill 0.305 mm

## Board
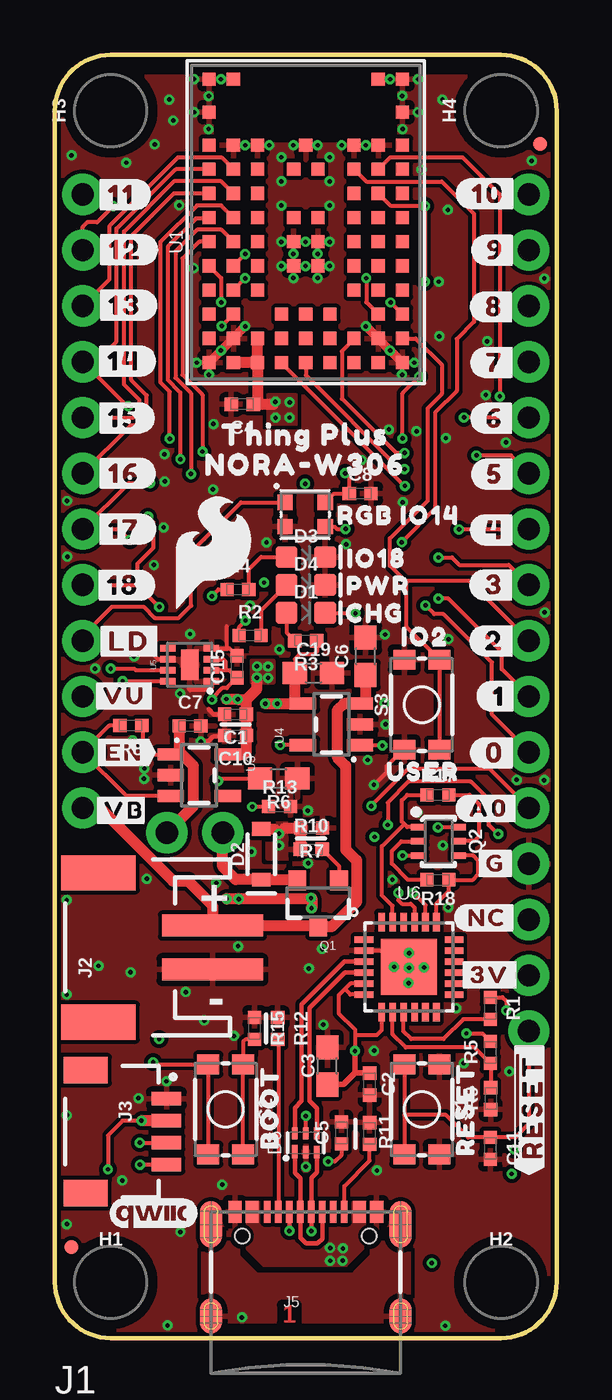
[diagram p1: board, top side]
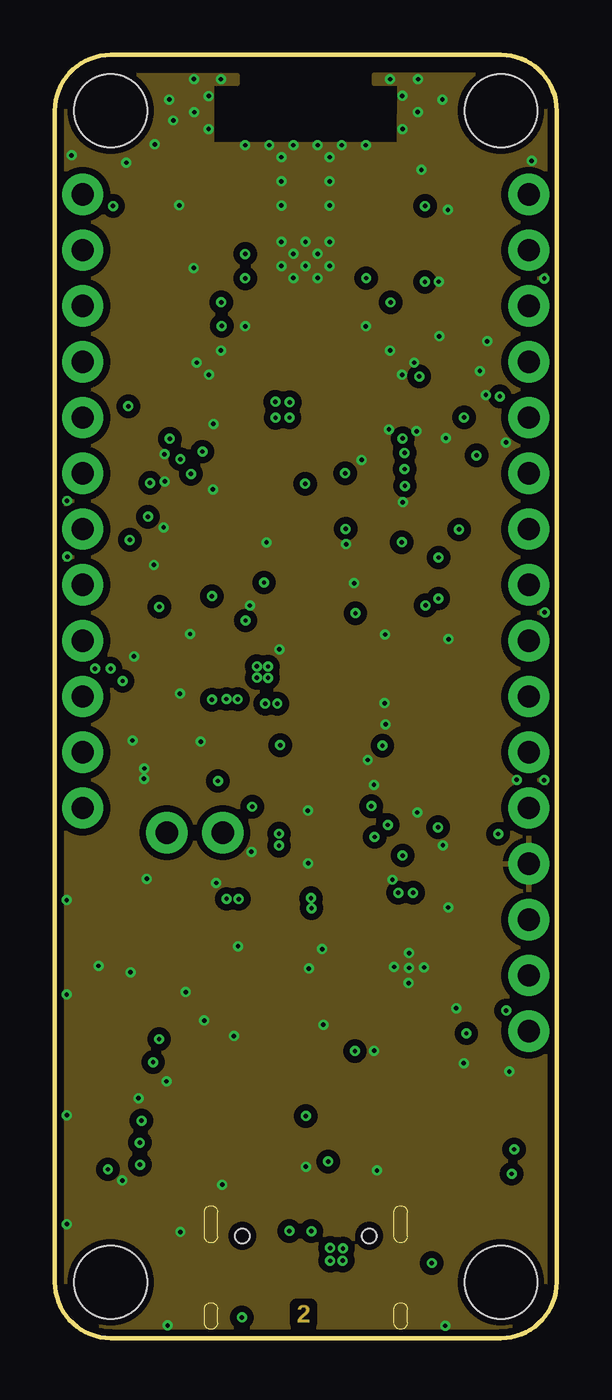
[diagram p2: board, inner layer Route2]
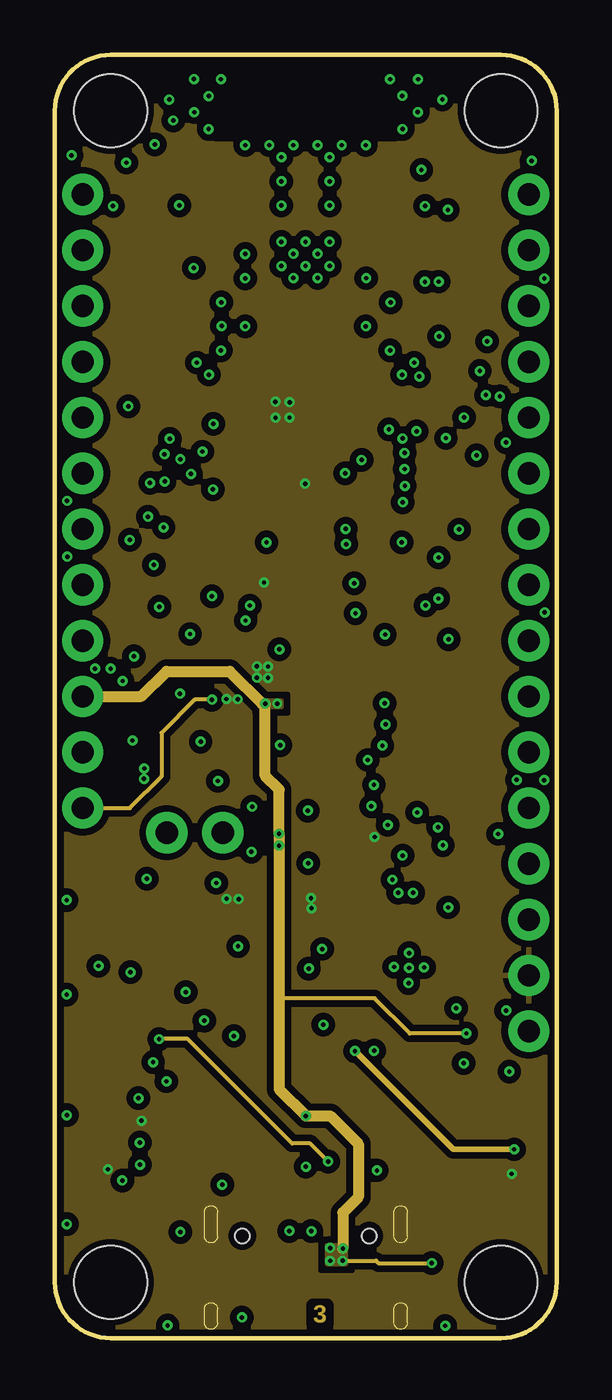
[diagram p3: board, inner layer Route15]
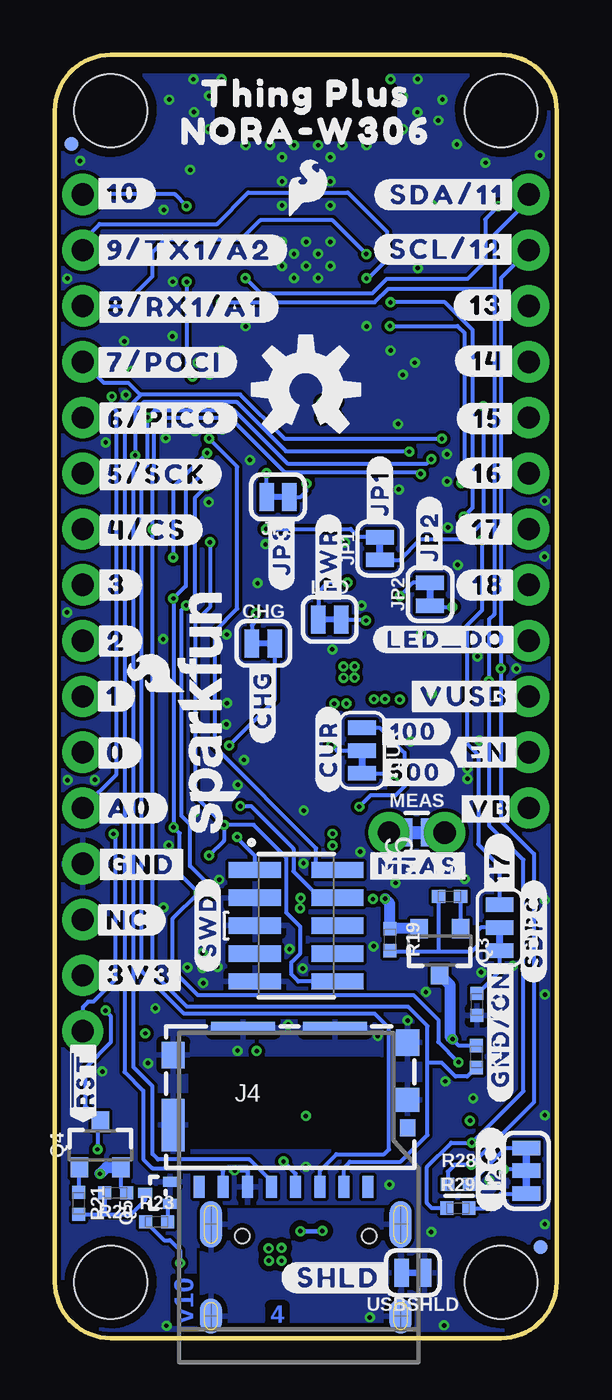
[diagram p4: board, bottom side, seen from below]

Size 22.86 x 58.42 mm. Coordinates in mm from the lower left corner, seen from the top.
Outline: 22.86,2.54 22.86,55.88 arc90 20.32,58.42 2.54,58.42 arc90 0,55.88 0,2.54 arc90 2.54,0 20.32,0 arc90 22.86,2.54
Copper layers (1*2*15*16): Top 0.035559375mm / dielectric 0.47751875mm / Route2 0.035559375mm / dielectric 0.47751875mm / Route15 0.035559375mm / dielectric 0.47751875mm / Bottom 0.035559375mm
Design rules "SparkFun-4-Layer-Minimum-JLCPCB": minimum track width 5mil, minimum drill 0.2mm, track to track 5mil, track to pad 5mil, pad to pad 5mil, via to via 5mil, smd to smd 5mil, copper to edge 7mil, drill to drill 7mil, minimum pad ring 5mil, minimum via ring 5mil, stop-mask expansion 2.5mil, vias tented up to drill 25mil, thermal gap 10mil
tRestrict: area 17.6,16.8 to 17.6,17; area 16.1,18.3 to 16.2,18.4; area 14.7,16.8 to 14.7,17; area 16.1,15.4 to 16.2,15.5

### Footprints (pad centres in the part's own frame; a part is rotated, then mirrored left to right if it is on the bottom)
0402-TIGHT = smd 0.6 x 0.6: 1 -0.5,0; 2 0.5,0
0603 = smd 1.1 x 1: 1 -0.85,0; 2 0.85,0
SMT-JUMPER_2_NC_TRACE_SILK = smd 0.66 x 1.27: 1 -0.521,0; 2 0.521,0
SMT-JUMPER_3_1-NC_TRACE_SILK = smd 0.66 x 1.27: 1 -1.041,0; 2 0,0; 3 1.041,0
LED-0603 = smd 1 x 1: A -0.877,0; C 0.877,0
SOD-323 = smd 0.63 x 0.83: A 1.15,0; C -1.15,0
WS2812-2020 = smd 0.7 x 0.7: DI -0.915,0.55; DO 0.915,-0.55; GND 0.915,0.55; VCC -0.915,-0.55
SOT886 = smd 0.61 x 0.25: 1 -0.405,0.5 | smd 0.56 x 0.25: 2 -0.43,0; 3 -0.43,-0.5; 4 0.43,-0.5; 5 0.43,0; 6 0.43,0.5
FIDUCIAL-MICRO = smd 0.635 x 0.635: 1 0,0
STAND-OFF = hole 3.302: 0,0
SMT-JUMPER_3_2-NC_TRACE_SILK = smd 0.66 x 1.27: 1 -1.041,0; 2 0,0; 3 1.041,0
THING_PLUS = drill 1.016 pad 1.88: 1 1.27,52.07; 2 1.27,49.53; 3 1.27,46.99; 4 1.27,44.45; 5 1.27,41.91; 6 1.27,39.37; 7 1.27,36.83; 8 1.27,34.29; 9 1.27,31.75; 10 1.27,29.21; 11 1.27,26.67; 12 1.27,24.13; 13 21.59,52.07; 14 21.59,49.53; 15 21.59,46.99; 16 21.59,44.45; 17 21.59,41.91; 18 21.59,39.37; 19 21.59,36.83; 20 21.59,34.29; 21 21.59,31.75; 22 21.59,29.21; 23 21.59,26.67; 24 21.59,24.13; 25 21.59,21.59; 26 21.59,19.05; 27 21.59,16.51; 28 21.59,13.97
JST-2-SMD = smd 1 x 4.6: 1 -1,-3.7; 2 1,-3.7 | smd 1.6 x 3.4: NC1 -3.4,1.5; NC2 3.4,1.5
JST04_1MM_RA = smd 0.6 x 1.35: 1 -1.5,0; 2 -0.5,0; 3 0.5,0; 4 1.5,0 | smd 1.2 x 2: NC1 2.8,-3.675; NC2 -2.8,-3.675
MICROSD_TINY = smd 0.5 x 1: 1 3.55,-3.85; 2 2.45,-3.85; 3 1.35,-3.85; 4 0.25,-3.85; 5 -0.85,-3.85; 6 -1.95,-3.85; 7 -3.05,-3.85; 8 -4.15,-3.85 | smd 0.72 x 0.78: 9 5.35,-1.17 | smd 1.05 x 1.08: GND1 5.35,0.1 | smd 1.05 x 1.2: GND2 5.35,2.71; GND3 -5.325,2.14 | smd 1.05 x 2.39: GND4 -5.325,-1.045 | smd 2.91 x 0.55: GND5 -2.145,3.385; GND6 2.045,3.385
USB-C-16P-4LAYER-ISOLATED = smd 0.3 x 1: A5 -1.25,-0.34; A6 -0.25,-0.34; A7 0.25,-0.34; A8 1.25,-0.34; B5 1.75,-0.34; B6 0.75,-0.34; B7 -0.75,-0.34; B8 -1.75,-0.34 | smd 0.6 x 1: GND -3.225,-0.34; GND2 3.225,-0.34; VBUS1 -2.45,-0.34; VBUS2 2.45,-0.34 | smd 1 x 2.1: SHLD1 -4.32,-0.915; SHLD2 4.32,-0.915 | smd 1 x 2.1 bottom: SHLD3 -4.32,-0.915; SHLD4 4.32,-0.915 | smd 1 x 1.6: SHLD5 -4.32,-5.095; SHLD8 4.32,-5.095 | smd 1 x 1.6 bottom: SHLD6 -4.32,-5.095; SHLD7 4.32,-5.095 | hole 0.65: -2.89,-1.445; 2.89,-1.445
2X5-SMD-UNSHROUDED_DNP_NO_PASTE = smd 0.74 x 2.38: 1 -2.54,-1.88; 2 -2.54,1.88; 3 -1.27,-1.88; 4 -1.27,1.88; 5 0,-1.88; 6 0,1.88; 7 1.27,-1.88; 8 1.27,1.88; 9 2.54,-1.88; 10 2.54,1.88
COMBO-JUMPER_2_NC_TRACE = smd 0.635 x 1.27: 1 -0.508,0; 2 0.508,0 | drill 1.016 pad 1.88: 3 -1.27,0; 4 1.27,0
SOT23-3 = smd 0.8 x 0.9: 1 -0.95,-1; 2 0.95,-1; 3 0,1.1
SC70-6 = smd 0.3 x 0.66: 1 -0.65,-0.92; 2 0,-0.92; 3 0.65,-0.92; 4 0.65,0.92; 5 0,0.92; 6 -0.65,0.92
SOT-416FL = smd 0.46 x 0.65: 1 -0.5,-1.1; 2 0.5,-1.1; 3 0,0.05
TACTILE_SWITCH_SMD_4.6X2.8MM = smd 0.9 x 1: 1 -2.05,-0.8; 2 2.05,-0.8; 3 2.05,0.8; 4 -2.05,0.8
UBLOX-NORA-W3 = smd 0.6 x 0.6: A1 -5.5,-4.4; A2 -5.5,-3.3; A3 -5.5,-2.2; A4 -5.5,-1.1; A5 -5.5,0; A6 -5.5,1.1; A7 -5.5,2.2; A8 -5.5,3.3; A9 -5.5,4.4; B1 -4.4,-4.4; B2 -4.4,-3.3; B3 -4.4,-2.2; B4 -4.4,-1.1; B5 -4.4,0; B6 -4.4,1.1; B7 -4.4,2.2; B8 -4.4,3.3; B9 -4.4,4.4; C1 -3.3,-4.4; C2 -3.3,-3.3; C4 -3.3,-1.1; C5 -3.3,0; C6 -3.3,1.1; C8 -3.3,3.3; C9 -3.3,4.4; D1 -2.2,-4.4; D2 -2.2,-3.3; D3 -2.2,-2.2; D7 -2.2,2.2; D8 -2.2,3.3; D9 -2.2,4.4; E1 -1.1,-4.4; E2 -1.1,-3.3; E3 -1.1,-2.2; E4 -1.1,-0.55; E5 -1.1,0.55; E7 -1.1,2.2; E8 -1.1,3.3; E9 -1.1,4.4; F1 0,-4.4; F2 0,-3.3; F3 0,-2.2; F4 0,-0.55; F5 0,0.55; F7 0,2.2; F8 0,3.3; F9 0,4.4; G1 1.1,-4.4; G2 1.1,-3.3; G3 1.1,-2.2; G4 1.1,-0.55; G5 1.1,0.55; G7 1.1,2.2; G8 1.1,3.3; G9 1.1,4.4; H1 2.2,-4.4; H2 2.2,-3.3; H3 2.2,-2.2; H7 2.2,2.2; H8 2.2,3.3; H9 2.2,4.4; J1 3.3,-4.4; J2 3.3,-3.3; J3 3.3,-2.2; J4 3.3,-0.55; J5 3.3,0.55; J7 3.3,2.2; J8 3.3,3.3; J9 3.3,4.4; K1 4.4,-4.4; K2 4.4,-3.3; K3 4.4,-2.2; K5 4.4,0; K7 4.4,2.2; K8 4.4,3.3; K9 4.4,4.4; L1 5.9,-4.4; L9 5.9,4.4; M1 7.4,-4.4; M2 7.4,-3.3; M8 7.4,3.3; M9 7.4,4.4
SOT23-5 = smd 0.55 x 1.2: 1 -0.95,-1.3; 2 0,-1.3; 3 0.95,-1.3; 4 0.95,1.3; 5 -0.95,1.3
DFN-8 = smd 0.3 x 0.7: 1 -0.75,-0.99; 2 -0.25,-0.99; 3 0.25,-0.99; 4 0.75,-0.99; 5 0.75,0.99; 6 0.25,0.99; 7 -0.25,0.99; 8 -0.75,0.99 | smd 1.38 x 0.8: 9 0,0
QFN24 = smd 0.85 x 0.3: 1 -2.05,1.25; 2 -2.05,0.75; 3 -2.05,0.25; 4 -2.05,-0.25; 5 -2.05,-0.75; 6 -2.05,-1.25; 13 2.05,-1.25; 14 2.05,-0.75; 15 2.05,-0.25; 16 2.05,0.25; 17 2.05,0.75; 18 2.05,1.25 | smd 0.3 x 0.85: 7 -1.25,-2.05; 8 -0.75,-2.05; 9 -0.25,-2.05; 10 0.25,-2.05; 11 0.75,-2.05; 12 1.25,-2.05; 19 1.25,2.05; 20 0.75,2.05; 21 0.25,2.05; 22 -0.25,2.05; 23 -0.75,2.05; 24 -1.25,2.05 | smd 2.55 x 2.55: PAD 0,0

### Placement (x,y rotation side)
C1  8.22,28.4 180 top
C2  14.34,11.56 270 top
C3  12.41,12.39 90 top
C4  8.53,42.51 180 top
C5  13.05,9.34 90 top
C6  14.15,31.04 90 top
C7  6.15,27.87 0 top
C8  13.9,38.45 0 top
C10  8.23,27.43 180 top
C11  19.83,8.64 270 top
C15  8.3,30.56 90 top
C19  11.78,30.27 0 top
CHG  13.36,31.63 0 bottom
CUR  8.86,26.75 270 bottom
D1  11.43,33.02 0 top
D2  9.4,22.02 90 top
D3  11.43,35.56 0 top
D4  11.43,34.29 0 top
D5  11.4,37.5 180 top
D6  11.43,8.89 90 top
FD1  22.1,54.36 0 top
FD2  22.1,54.36 0 bottom
FD3  0.74,4.14 0 top
FD4  0.74,4.14 0 bottom
FRAME1  -17.14,-20.32 0 top  (outside the outline)
H1  2.54,2.54 0 top
H2  20.32,2.54 0 top
H3  2.54,55.88 90 top
H4  20.32,55.88 90 top
I2C  1.39,7.62 90 bottom
J1  0,0 0 top
J2  3.48,17.78 90 top
J3  5.08,9.4 270 top
J4  12.14,10.74 0 bottom
J5  11.43,6.1 0 top
J6  11.87,18.78 270 bottom
JP1  8.06,35.95 90 bottom
JP2  5.77,33.87 90 bottom
JP3  12.7,38.3 180 bottom
LED  10.34,32.72 0 bottom
LOGO2  11.43,43.18 0 bottom
LOGO3  15.87,28.54 90 bottom
LOGO6  4.5,5.67 0 top
MEAS  6.38,23.01 0 bottom
Q1  11.99,19.84 180 top
Q2  17.47,22.62 270 top
Q3  5.33,17.64 180 bottom
Q4  20.79,8.77 0 bottom
Q5  18.7,6.62 90 bottom
R1  19.83,15.01 270 top
R2  8.89,31.98 0 top
R3  11.43,31.75 180 top
R4  8.34,34.08 0 top
R5  19.83,13.01 90 top
R6  10.19,25.47 180 top
R7  11.69,23.22 180 top
R8  3.46,27.88 180 top
R9  19.85,10.9 90 top
R10  11.68,22.25 0 top
R11  14.34,9.31 270 top
R12  10.15,14.09 270 top
R13  10.24,24.21 0 top
R14  4.88,20.1 0 bottom
R15  9.09,14.1 270 top
R16  3.67,12.81 270 bottom
R17  17.45,24.73 0 top
R18  17.45,20.87 180 top
R19  7.6,18.14 270 bottom
R20  20.09,6.61 180 bottom
R21  21.77,6.14 270 bottom
R22  3.64,15.19 270 bottom
R23  18.22,5.29 0 bottom
R28  4.47,7.01 0 bottom
R29  4.5,5.91 0 bottom
S1  16.71,10.41 270 top
S2  7.78,10.41 270 top
S3  16.71,28.83 90 top
SDPC  2.6,18.68 270 bottom
U1  11.43,49.91 90 top
U3  6.57,25.63 270 top
U4  12.6,27.94 90 top
U5  6.14,30.65 90 top
U6  16.13,16.89 0 top
U$1  [#17#11]  3.16,36.83 0 top
U$2  [BOOT0]  9.78,10.52 90 top
U$3  [#MEAS#1714141838]  6.34,21.49 0 bottom
U$4  [IO180]  14.66,35.5 0 top
U$5  [NORA#W3060]  11.39,39.76 0 top
U$6  [##RST##23061714141845]  21.58,11.72 90 bottom
U$7  [USER0]  16.76,25.78 0 top
U$8  [SFE_LOGO_FLAME_.2]  7.22,35.74 0 top
U$9  [IO20]  16.86,31.93 0 top
U$10  [#GND#ON#3061714141842]  2.56,14.06 90 bottom
U$11  [#SDPC#0]  1.05,18.51 90 bottom
U$12  [#A0#1]  19.44,24.12 0 bottom
U$13  [#SDA#11#28]  5,52.05 0 bottom
U$14  [#17#28]  3.15,36.83 0 bottom
U$15  [#0#4]  20.06,26.64 0 bottom
U$16  [#1#4]  20.22,29.22 0 bottom
U$17  [#SCL#12#28]  5.02,49.57 0 bottom
U$18  [#18#28]  3.11,34.27 0 bottom
U$19  [SFE_LOGO_FLAME_.1]  12.48,50.73 0 bottom
U$20  [#LD#29]  3.38,31.72 0 top
U$21  [RGB_IO140]  15.66,37.45 0 top
U$22  [#17#11]  2.61,21.47 90 bottom
U$23  [PWR0]  14.73,34.25 0 top
U$24  [#CUR#0]  10.4,26.8 90 bottom
U$25  [THING_PLUS1714141839]  11.41,56.66 0 bottom
U$26  [#VB26]  3.08,24.09 0 bottom
U$28  [NORA#W3061714141840]  11.43,54.95 0 bottom
U$30  [#13#13]  3.22,47.03 0 bottom
U$31  [#14#14]  3.17,44.48 0 bottom
U$32  [#15#15]  3.13,41.87 0 bottom
U$33  [#16#16]  3.14,39.37 0 bottom
U$35  [#18#18]  3.11,34.27 0 top
U$36  [#11#91420]  3.03,52.06 0 top
U$37  [#12#91420]  3.21,49.55 0 top
U$38  [#13#91420]  3.19,47.02 0 top
U$39  [#14#91420]  3.14,44.48 0 top
U$40  [#15#91420]  3.12,41.89 0 top
U$41  [#VUSB#0]  1.5,29.21 0 bottom
U$42  [#JP3#23061714141846]  12.53,35.87 90 bottom
U$43  [#EN#0]  1.5,26.67 0 bottom
U$44  [#16#91420]  3.15,39.37 0 top
U$45  [#3V3#0]  21.19,16.52 0 bottom
U$46  [#NC#2]  19.53,19.03 0 bottom
U$47  [#A0#18]  19.76,24.11 0 top
U$48  [#8#91421]  20.03,46.95 0 top
U$49  [#7#8]  20.06,44.41 0 top
U$50  [#6#8]  20.04,41.88 0 top
U$51  [#5#8]  20.07,39.33 0 top
U$52  [#4#8]  20.04,36.79 0 top
U$53  [#3#8]  20.03,34.29 0 top
U$54  [#2#8]  20.03,31.74 0 top
U$55  [#1#8]  20.22,29.22 0 top
U$56  [#0#8]  20.05,26.64 0 top
U$57  [#3V#23]  19.8,16.53 0 top
U$58  [#JP2#0]  5.79,36.49 90 bottom
U$59  [ORDERING_INSTRUCTIONS]  41.91,50.8 0 top  (outside the outline)
U$60  [#SWD#501]  15.9,18.79 90 bottom
U$61  [#100#23061714141846]  6.53,27.6 0 bottom
U$62  [THING_PLUS_0]  11.57,41.13 0 top
U$63  [#SHLD#9]  9.94,2.75 0 bottom
U$64  [#GND#10]  18.91,21.55 0 bottom
U$65  [#JP1#0]  8.06,38.45 90 bottom
U$66  [#PWR#14]  10.39,35.41 90 bottom
U$67  [#CHG#13]  13.4,29.05 90 bottom
U$68  [##RESET##19]  21.62,10.53 90 top
U$69  [#NC#21]  19.69,19.14 0 top
U$70  [#9#10]  20.08,49.54 0 top
U$71  [#LED_DO#0]  5.02,31.81 0 bottom
U$72  [#I2C#3]  3,7.68 90 bottom
U$73  [#500#23061714141846]  6.42,25.75 0 bottom
U$74  [#10#11]  19.74,52.11 0 top
U$75  [#G#22]  20.06,21.6 0 top
U$76  [#VU#23]  3.15,29.24 0 top
U$77  [#VB26]  3.16,24.03 0 top
U$78  [CHG0]  14.57,32.99 0 top
U$79  [RESET0]  18.7,10.43 90 top
U$80  [#EN#27]  3.14,26.66 0 top
U$81  [#2#28]  20.03,31.73 0 bottom
U$82  [#3#28]  20.03,34.29 0 bottom
U$83  [#4#CS#28]  18.65,36.79 0 bottom
U$84  [#5#SCK#28]  18.22,39.32 0 bottom
U$85  [#6#PICO#28]  17.85,41.88 0 bottom
U$86  [#7#POCI#28]  17.89,44.42 0 bottom
U$87  [#9#TX1#A2#28]  16.74,49.53 0 bottom
U$88  [#8#RX1#A1#28]  16.92,46.94 0 bottom
U$91  [#10#28]  19.74,52.11 0 bottom
USBSHLD  6.55,2.97 180 bottom

### Tracks (layer width: path | path; a pad name or v marks a point on that pad's centre or on a via)
3.3V  (via drill 0.2)
  Top 0.178: 9.95,42.51 9.94,42.52 v10.04,42.63 | C1.1 | v3.95,9.9 v3.95,9.89 3.09,9.89 2.42,9.22 v2.42,7.68
  Top 0.254: 9.23,42.51 C4.1
  Top 0.508: U1.A7 U1.A8 | U1.A7 U1.B7 | C4.1 9.95,42.51 | U1.A7 9.23,42.51 | C1.1 8.72,29.08 | v9.21,30.07 9.21,29.56 8.72,29.08 | C1.1 C10.1 8.73,26.68 8.62,26.58 U3.5 | J3.2 v3.95,9.9 | v7.82,20 v7.82,19.99 v8.37,19.99 v8.38,19.98 11.66,19.98 11.7,20.02 11.7,19.58 v11.69,19.57 | v7.82,29.09 8.32,29.09 v8.33,29.08 8.72,29.08
  Bottom 0.178: v9.53,34.4 10.43,34.4 10.86,33.98 LED.1 | I2C.2 1.45,7.68 v2.42,7.68 | J6.1 13.75,21.95 14.56,22.76 v14.56,22.81 | R20.1 19.84,6.86 Q4.2 | JP3.1 11.66,38.3 11.4,38.55 v11.4,38.9
  Bottom 0.508: v20.81,7.48 20.51,7.77 Q4.2 | Q3.2 R19.1 7.6,19.78 v7.82,20
  other vias: 10.69,42.61 10.69,41.91 10.05,41.9 9.2,30.58 9.71,30.57 9.71,30.06 11.66,20.03
  pour Route15 (isolate 0.305, rank 2): 0,58.37 7.14,58.37 7.14,54.36 15.7,54.36 15.7,58.37 22.86,58.37 22.86,0 0,0
  pour Top (isolate 0.305): 10.99,42.92 9.7,42.92 9.7,41.63 10.99,41.63
  pour Top (isolate 0.203): 9.95,29.83 8.98,29.83 8.98,30.85 9.95,30.85
!RESET!  (via drill 0.2)
  Top 0.178: S1.1 15.91,10.16 | 15.91,10.16 S1.2 | v20.19,22.95 20.17,22.95 19.77,23.36 19.77,24.51 18.94,25.33 16.11,25.33 15.16,24.38 v15.16,23.36 | v15.84,21.97 Q2.3 | U1.J3 14.18,52.66 17.62,52.66 19.09,51.19 19.09,46.27 18.3,45.49 18.3,43.11 17.32,42.13 17.32,37.76 v15.8,36.24 | J1.28 21.59,9.75 20.98,9.14 C11.1 18.83,9.14 17.8,10.16 15.91,10.16
  Bottom 0.178: v20.19,22.95 20.11,22.86 20.11,16.31 21.11,15.31 21.34,15.31 21.59,15.06 J1.28 | v15.16,23.36 15.16,22.64 v15.84,21.97 | v15.8,36.24 15.8,33.28 16.48,32.6 16.48,24.68 v15.16,23.36 | J6.10 11.77,16.24 12.09,16.56 12.09,17.11 11.68,17.52 11.68,18.73 12.31,19.36 12.31,21.86 13.81,23.36 v15.16,23.36
CC1
  Top 0.178: R12.2 10.18,13.57 J5.A5
CC2
  Top 0.178: J5.B5 13.18,6.91 14.34,8.07 R11.2
CHG  (via drill 0.2)
  Top 0.178: U4.1 14.9,26.99 v14.92,26.97
  Bottom 0.178: CHG.2 12.84,29.05 v14.92,26.98 v14.92,26.97
DTR
  Top 0.178: Q2.1 16.05,23.27 15.91,23.4 | 15.91,23.4 15.81,23.51 15.81,24.48 16.06,24.73 R17.1 | 15.91,23.4 14.89,22.38 14.89,20.16 15.38,19.68 U6.23
EN
  Top 0.178: U3.3 3.26,24.68 J1.11 2.48,27.88 R8.2
GND  (via drill 0.2)
  Top 0.178: 14.73,45.5 U1.B2 | 8.12,45.51 U1.B8 | v7.57,44.96 7.57,44.95 | v15.27,44.96 v15.28,44.96 | U6.2 14.95,17.64 | U6.PAD v16.13,17.52 v16.14,17.53 | U5.4 7.88,31.4 | 7.88,31.4 7.95,31.4 C15.2 | U5.1 7.13,29.58 7.05,29.5 6.15,29.5 6.1,29.55 | U5.6 4.7,30.9 4.58,31.02 4.58,31.73 4.59,31.74 | 7.88,31.4 7.84,31.44 7.84,32.4 | v14.53,25.18 15.12,25.77 15.12,26.04 15.86,26.78 S3.4 | v15.27,57.31 | v15.27,57.31 15.12,57.31 v15.27,57.31 | U1.M2 | U1.M2 v15.27,57.31 | U1.M8 v7.57,57.31
  Top 0.203: C10.2 7.68,27.39 7.21,27.39 6.97,27.15 v6.64,27.15 | C1.2 7.22,28.4 6.99,28.63
  Top 0.406: v15.27,44.96 14.73,45.5 v14.16,46.06 | v7.57,44.96 8.12,45.51 v8.66,46.06 | 7.57,44.95 U1.A9 | v15.28,44.96 U1.A1
  Bottom 0.178: v14.67,7.63 14.09,7.63 J4.6
  other vias: 7,55.04 7.01,56.55 6.34,57.32 15.84,55.04 15.83,56.56 16.55,57.31 8.67,54.31 9.77,54.31 13.07,54.31 14.17,54.31 11.97,49.36 11.42,49.91 10.87,49.36 11.42,48.81 11.97,48.26 12.52,48.81 12.52,49.91 10.32,49.91 10.32,48.81 10.87,48.26 7.02,43.86 6.47,44.41 15.82,43.86 16.37,44.41 11.97,54.31 10.87,54.31 16.53,55.82 6.35,55.81 12.52,51.56 12.52,52.66 10.32,51.56 10.32,52.66 12.52,53.76 10.32,53.76 11.43,7.8 15.06,27.94 6.8,14.45 4.06,25.46 11.52,24.02 12.17,17.71 16.13,16.85 15.45,16.9 16.82,16.87 16.11,16.16 9.64,36.23 8.16,13.75 14.54,13.08 20.7,12.14 17.78,0.56 5.13,0.57 0.54,5.18 0.54,10.15 0.54,15.64 0.54,19.94 11.57,16.82 5.96,15.75 8.34,17.83 5.21,56.39 0.76,53.85 17.65,56.39 21.72,53.59 15.04,32.03 15.02,28.9 8.95,22.14 4.51,35.2 13.26,36.15 13.63,34.37 15.85,38.06 3.81,10.92 5.08,11.68 7.62,6.99 5.71,4.83 3.25,53.51 4.55,54.35 5.69,29.33 3.07,7.18 15.38,20.87 17.68,22.43 16.5,23.93 17.81,40.97 19.7,45.38 10.23,31.35 8.88,33.35 5.4,55.44 20.55,40.78 19.36,44.03 17.9,51.37 16.69,53.19 17.51,45.61 12.23,14.26 18.62,12.51 7.2,38.64 7.22,41.62 4.99,40.24 5.66,51.57 0.56,35.57 0.55,38.12 22.31,33.04 22.29,25.41 18.28,15.01 4.07,25.93 6.16,32.05 16.47,41.28 15.21,41.36 13.98,39.98 5,39 4.95,36.91 21.04,25.42 19.63,42.93 17.93,31.82 3.61,31.04 1.83,30.48 6.33,48.72 3.44,16.65 4.19,20.91 7.35,20.72 14.25,26.32 3.54,27.21 1.99,16.94 17.91,19.6 11.54,21.61 17.49,48.1 22.29,48.24
  pour Route2 (isolate 0.305): 0,57.53 7.16,57.5 8.33,57.5 8.33,57.11 7.17,57.11 7.16,54.36 15.67,54.36 15.69,57.11 14.53,57.11 14.53,57.51 22.86,57.51 22.86,0 0,0
  pour Top (isolate 0.178, rank 4): 0,0 0,58.42 22.86,58.42 22.86,0
  pour Bottom (isolate 0.152, rank 2): 0,0 22.86,0 22.86,58.42 0,58.42
N$1
  Top 0.178: U6.9 15.88,13.97 16.23,13.61 17.71,13.61 18.6,14.51 R1.2
N$2
  Top 0.178: R4.2 8.84,35 9.39,35.56 D3.A
N$3
  Top 0.178: R17.2 18.89,24.73 19.32,24.31 19.32,22.84 19.1,22.62 Q2.5
N$4
  Top 0.178: U6.8 15.38,13.83 15.98,13.23 19.12,13.23 R5.1 19.85,12.49 R9.2
N$5
  Top 0.178: R18.2 16.08,20.87 15.34,21.6 15.34,22.18 15.78,22.62 Q2.2
N$6  (via drill 0.2)
  Top 0.178: D1.C 13.67,33.02 v13.69,33
  Bottom 0.178: v13.69,33 13.69,32.64 13.88,32.44 CHG.1
N$7
  Top 0.178: R10.2 12.94,21.5 Q1.1
N$8
  Top 0.178: S2.3 S2.4 8.58,13.5 8.68,13.6 R15.2
N$9  (via drill 0.2)
  Top 0.178: U4.5 v10.27,26.99 v10.26,27
  Bottom 0.178: v10.26,27 10.02,26.75 CUR.2
N$10  (via drill 0.2)
  Top 0.178: D5.DI 12.74,36.95 12.85,36.84 v13.24,36.84
  Bottom 0.178: v13.24,36.84 9.39,36.84 9.01,36.47 JP1.2
N$11  (via drill 0.2)
  Top 0.178: v8.99,24.19 9,24.21 R13.1
  Bottom 0.178: CUR.1 8.08,27.79 6.93,26.64 6.93,25.11 7.33,24.72 8.46,24.72 v8.99,24.19
N$12  (via drill 0.2)
  Top 0.178: v8.69,32.67 8.39,32.37 R2.1 | v8.69,32.67
  Bottom 0.178: LED.2 8.74,32.72 v8.69,32.67
N$13  (via drill 0.2)
  Top 0.178: v7.43,25.36 7.53,25.47 R6.2
  Bottom 0.178: v7.43,25.36 7.77,25.7 CUR.3
N$14
  Top 0.178: D4.A 9.39,33.13 R2.2
N$15
  Top 0.203: D6.6 10.93,10.48 11.24,10.79 11.24,15.19 13.2,17.14 U6.3
N$16
  Top 0.203: D6.1 10.93,7.51 11.18,7.26 J5.A6 11.18,4.57 11.44,4.3 11.96,4.3 12.18,4.52 J5.B6
N$17
  Top 0.178: D1.A 10.55,32.13 R3.2
N$18
  Top 0.178: D6.4
  Top 0.203: D6.4 11.93,10.46 11.6,10.79 11.6,15.04 13.21,16.64 U6.4
N$19  (via drill 0.2)
  Top 0.178: v10.68,4.88 v10.68,4.87 | J5.A7
  Top 0.203: J5.A7 11.68,7.29 11.93,7.54 D6.3 | J5.B7 v10.68,4.88 | J5.A7 v11.68,4.87
  Bottom 0.178: v10.68,4.87 v10.69,4.87
  Bottom 0.203: v10.69,4.87 v11.68,4.87
N$20
  Bottom 0.178: R28.2 2.32,8.66 I2C.3
N$21
  Bottom 0.178: R29.2 3.21,5.91 2.55,6.58 I2C.1
N$22  (via drill 0.2)
  Top 0.178: v7.15,33.78 7.46,34.08 R4.1
  Bottom 0.178: JP2.2 6.54,34.39 v7.15,33.78
N$23
  Top 0.178: 11,20.87 Q1.2
  Top 0.508: 11,20.87 D2.C 8.24,20.87 7.64,21.46 MEAS.3
  Bottom 0.178: MEAS.1 MEAS.3
N$24
  Bottom 0.178: Q3.1 R14.2
N$25  (via drill 0.2)
  Top 0.178: C5.1 13.05,8.33 12.76,8.04 v12.44,8.04
  Route15 0.178: v12.44,8.04 11.62,8.86 10.8,8.86 6.05,13.61 v4.75,13.61
  Bottom 0.178: J4.4 11.89,7.48 v12.44,8.04 | R16.1 4.45,13.31 v4.75,13.61
  Bottom 0.508: v4.75,13.61 4.86,13.72 4.86,16.07 Q3.3
N$26
  Bottom 0.178: SDPC.2 3.46,18.68 3.61,18.54 3.61,17.86 3.89,17.58 5.38,17.58 | 5.38,17.58 7.55,17.58 R19.2 | R14.1 5.38,17.59 5.38,17.58
N$27
  Bottom 0.178: Q5.3 18.76,6.28 19.4,5.64 20.59,5.64 | R21.2 20.59,5.64 | R20.2 20.59,5.64
N$28  (via drill 0.2)
  Top 0.178: v13.22,39.38 13.4,39.19 C8.1 12.71,38.45 D5.VCC
  Bottom 0.178: JP3.2 v13.22,39.37 v13.22,39.38
N$29  (via drill 0.2)
  Top 0.178: U6.5 13.46,16.14 13.21,15.89 | 13.67,13.79 13.67,14.05 12.93,14.79 12.93,15.6 13.21,15.89 | 13.67,13.79 v13.67,13.07 | U6.6 13.46,15.64 13.21,15.89 | U6.7 14.88,14.01 14.66,13.79 13.67,13.79 | R1.1 20.39,15.51 20.55,15.35 v20.55,14.91
  Top 0.254: C3.1 13.14,11.54 13.7,12.09 | v13.67,13.07 13.67,12.12 13.7,12.09 | C2.1 13.73,12.06 13.7,12.09
  Route15 0.254: v20.92,8.59 18.15,8.59 v13.67,13.07
  Bottom 0.178: v20.92,8.59 20.92,9.75 Q4.3 21.49,10.56 21.49,12.29 20.32,13.45 20.32,14.67 v20.55,14.91
N$30
  Bottom 0.178: Q4.1 21.77,7.75 R21.1
N$31
  Bottom 0.178: Q5.1 17.72,6 R23.2
N$32
  Bottom 0.178: SDPC.3 2.6,16.69 3.6,15.69 R22.1
PA7/UART-LOG-TXD  (via drill 0.2)
  Top 0.178: v17.45,23.25 17.47,23.27 Q2.6 | v4.47,12.56 4.57,12.46 S2.1 S2.2 | U6.20 16.88,19.71 v16.31,20.27 | J1.22 20.35,30.45 20.35,31.23 17.92,33.67 v17.47,33.67 | U1.A5 11.43,43.83 15.7,39.56 v15.93,39.56
  Bottom 0.178: v4.47,12.56 5.4,13.48 5.4,14.49 6.51,15.61 16.34,15.61 17.49,16.75 17.49,19.1 v16.31,20.27 17.18,21.14 17.18,22.97 v17.45,23.25 17.45,33.65 v17.47,33.67 16.9,34.23 16.9,38.59 v15.93,39.56
PA8/UART-LOG-RXD  (via drill 0.2)
  Top 0.178: U6.21 16.38,19.6 16.21,19.77 15.8,19.77 15.64,19.93 v15.64,20.27 | J1.23 21.59,26.7 19.91,28.38 19.91,30.76 17.71,32.96 17.28,32.96 v16.88,33.35 | v15.94,38.79 15.93,38.79 10.33,44.39 U1.A6
  Bottom 0.178: v15.64,20.27 15.64,20.42 16.71,21.48 16.71,23.39 17.1,23.79 17.1,33.13 v16.88,33.35 16.5,33.74 16.5,38.24 v15.94,38.79
PA12  (via drill 0.2)
  Top 0.178: U1.J9 5.51,53.21 2.81,50.51 2.81,45.38 1.89,44.45 J1.4 3.3,42.42 v3.34,42.42
  Bottom 0.178: v3.34,42.42 v3.35,42.41 3.35,37.17 4.15,36.37 6.2,36.37 7.15,35.42 JP1.1
PA13
  Top 0.178: U1.J8 7.58,53.76 5.61,53.76 2.47,50.62 2.47,48.19 J1.3
PA14
  Top 0.178: U1.H9 5.42,52.11 3.48,50.17 3.48,43.62 4.19,42.91 4.19,41.97 3.77,41.54 3.44,41.54 J1.6
PA15
  Top 0.178: U1.H8 7.58,52.66 5.42,52.66 3.15,50.38 3.15,43.42 3.85,42.71 3.85,42.18 3.58,41.91 J1.5
PA25/SCL  (via drill 0.2)
  Top 0.178: v3.88,7.89 v3.88,7.9 J3.4 | U5.7 3.7,30.4 3.63,30.48 v2.54,30.48 | J1.2 1.27,50.59 1.48,50.8 1.92,50.8 v2.65,51.54 | v14.18,48.26 14.18,47.16 U1.C2
  Bottom 0.178: J1.2 2.54,48.26 v2.54,30.48 2.54,23.55 1.04,22.05 1.04,10.73 v3.88,7.89 4.65,7.89 4.97,7.57 R28.1 | v14.18,48.26 13.49,47.57 8.4,47.57 7.74,48.22 4.06,48.22 3.25,49.03 3.25,50.94 v2.65,51.54
PA26/SDA  (via drill 0.2, 0.2 pad 0.25)
  Top 0.178: v3.87,8.89 J3.3 | U5.8 3.12,29.9 3.11,29.91 v3.09,29.91 | U1.C1 v15.29,47.15
  Bottom 0.178: J1.1 1.27,51.82 2.85,50.23 2.85,47.78 | 2.85,47.78 2.85,32.95 3.09,32.71 v3.09,29.91 3.09,23.34 1.52,21.77 1.52,11.24 v3.87,8.89 4.81,8.89 5.91,7.79 5.91,6.14 5.69,5.91 R29.1 | v15.29,47.15 8.29,47.15 7.67,47.78 2.85,47.78
PA27/SWD_DATA  (via drill 0.2)
  Top 0.178: U1.H2 15.28,51.56 16.84,51.56 v16.86,51.54 v16.86,51.53 v16.86,48.09 | v15.83,40.95 15.83,43.02 v16.59,43.78
  Bottom 0.178: v16.86,51.54 17.39,52.07 J1.13 | J6.2 10.82,21.32 10.96,21.45 10.96,22.3 15.56,26.91 15.56,32.2 14.55,33.21 14.55,39.67 v15.83,40.95 | v16.59,43.78 16.85,44.04 v16.85,48.09 v16.86,48.09
PA28  (via drill 0.2)
  Top 0.178: U1.B3 13.63,45.49 13.08,44.93 13.08,42.77 15.55,40.3 v15.93,40.3 | v17.47,35.53 18.09,35.53 18.42,35.2 20.68,35.2 J1.20
  Bottom 0.178: v15.93,40.3 17.47,38.75 v17.47,35.53
PA30
  Top 0.178: U1.B1 16.42,45.51 17.62,44.31 17.62,42.98 16.97,42.33 16.97,38.12 15.26,36.4 15.26,35.17 15.96,34.46 | J1.21 18.88,34.46 15.96,34.46 | S3.1 S3.2 16.02,32.37 16.02,34.4 15.96,34.46
PB1/LP_UART_TXD/A2  (via drill 0.2)
  Top 0.178: v8.67,48.25 U1.D8
  Bottom 0.178: J1.14 21.59,49.96 20.82,50.72 15.48,50.72 14.05,52.15 9.52,52.15 7.73,50.37 7.73,49.1 8.58,48.25 v8.67,48.25
PB2/LP_UART_RXD/A1  (via drill 0.2)
  Top 0.178: U1.E8 v8.67,49.35
  Bottom 0.178: J1.15 19.77,46.99 18.41,48.34 18.41,49.45 17.84,50.03 14.37,50.03 13.51,50.89 10.21,50.89 v8.67,49.35
PB3/SWD_CLK/A0  (via drill 0.2)
  Top 0.178: U1.J2 15.28,53.76 18.57,53.76 20.27,52.06 v20.27,42.87 | J1.24 19.82,25.91 16.08,25.91 14.41,24.24 v14.41,24.22
  Bottom 0.178: v20.27,42.87 20.27,42.42 20.08,42.23 20.08,25.64 J1.24 | v14.41,24.22 13.92,24.22 12,22.29 12,21.25 10.79,20.05 J6.4
PB18/SPI0_PICO  (via drill 0.2)
  Top 0.178: J1.17 20.05,41.91 v18.64,41.91 | U1.G9 6.99,50.97 6.43,50.97 5.14,49.68 5.14,43.63 5.71,43.05 v5.71,40.02
  Bottom 0.178: J4.3 10.79,7.61 10.04,8.36 7.86,8.36 7.64,8.58 7.64,14.12 8.29,14.77 16.97,14.77 18.9,16.7 18.9,39.49 18.65,39.74 18.65,41.9 v18.64,41.91 18.3,42.25 14.7,42.25 12.27,39.82 5.91,39.82 v5.71,40.02
PB19/SPI0_POCI  (via drill 0.2)
  Top 0.178: U1.G8 7.58,51.56 6.47,51.56 4.8,49.9 4.8,43.52 5.23,43.09 v5.23,40.95
  Bottom 0.178: J4.7 15.19,7.6 15.33,7.74 18.42,7.74 18.83,8.15 18.83,11.26 19.69,12.12 19.69,42.2 18.93,42.96 | J1.16 20.64,43.49 19.52,43.49 18.99,42.96 18.93,42.96 | v5.23,40.95 12.4,40.95 14.42,42.96 18.93,42.96
PB20/SPI0_CLK  (via drill 0.2)
  Top 0.178: J1.18 20.77,40.19 v19.2,40.19 | v6.72,40.36 6.72,42.95 5.81,43.86 5.81,49.15 6.58,49.91 U1.F9
  Bottom 0.178: J4.5 12.99,7.13 13.99,8.13 18.16,8.13 18.41,8.38 18.41,11.47 19.27,12.32 19.27,39.64 19.2,39.71 v19.2,40.19 19.2,42.23 18.82,42.61 14.57,42.61 12.34,40.38 6.74,40.38 v6.72,40.36
PB21/SPI0_CS  (via drill 0.2)
  Top 0.178: J1.19 21.57,36.81 v18.41,36.81 | U1.F8 7.58,50.46 6.47,50.46 5.49,49.48 5.49,43.72 6.2,43.02 v6.2,39.34
  Bottom 0.178: J4.2 9.69,7.75 9.42,8.02 7.11,8.02 5.89,9.25 5.89,12.53 | 5.89,12.53 5.89,14.21 6.76,15.09 16.84,15.09 18.41,16.66 18.41,36.27 18.41,36.26 v18.41,36.81 18.41,39.46 18.33,39.55 18.33,41.44 17.86,41.9 14.87,41.9 12.38,39.41 6.26,39.41 v6.2,39.34 | R16.2 4.08,11.9 4.61,11.9 5.24,12.53 5.89,12.53
PB22  (via drill 0.2)
  Top 0.178: 3.75,34.29 v4.75,33.29 | J1.8 3.75,34.29 | U1.E9 7.58,48.26 v7.58,47.16 | v4.24,37.39 4.48,37.15 4.48,35.97 3.75,35.25 3.75,34.29
  Bottom 0.178: v7.58,47.16 5.09,47.16 3.82,45.89 3.82,37.8 v4.24,37.39 | JP2.1 5.71,33.29 v4.75,33.29
PB23/SDPC  (via drill 0.2)
  Top 0.178: v7.6,46.08 | U1.C8 v7.6,46.08 | v4.34,38.93 3.37,38.93 J1.7 2.92,36.83 v3.41,36.34
  Bottom 0.178: v7.6,46.08 4.52,46.08 4.19,45.76 4.19,39.56 4.34,39.42 v4.34,38.93 | v3.41,36.34 3.41,33.12 4.1,32.44 4.1,27.07 3.58,26.55 3.58,22.48 2.6,21.5 SDPC.1
RTS
  Top 0.178: Q2.4 19.06,21.97 19.3,21.73 19.3,21.12 19.04,20.87 R18.1 17.95,20.35 17.38,19.78 U6.19
USB_SHLD  (via drill 0.2)
  other vias: 8.52,0.93
  pour Top (isolate 0.254, rank 2): 16.15,5.31 6.73,5.31 6.73,0.76 16.15,0.76
  pour Bottom (isolate 0.254): 6.73,0.76 16.15,0.76 16.15,5.84 6.73,5.84
V_BATT  (via drill 0.2)
  Top 0.178: 11.95,18.78 Q1.3 | v7.15,29.07 7.15,29.13 7.61,29.59 7.83,29.59 C15.1 7.96,30.39 7.77,30.39 | U5.2 7.77,30.39 | U5.3 7.66,30.9 7.67,30.91 7.77,30.8 7.77,30.39
  Top 0.508: J1.12 2.06,24.13 5.38,20.8 6.07,20.8 7.18,19.69 J2.2 11.95,18.78 | Q1.3 12.61,18.74 13.74,19.86 13.74,21.75 13.25,22.24 13.25,26.05 12.88,26.42 12.88,28.61 13.16,28.89 U4.3 14.08,28.89 14.13,28.94 14.13,30.17 C6.1
  Route15 0.178: J1.12 3.41,24.13 4.85,25.57 4.85,27.55 6.37,29.07 v7.15,29.07
V_USB  (via drill 0.2)
  Top 0.178: D6.5 v11.43,10.11 | R5.2 19.48,13.87 v18.74,13.87 | v10.21,22.96 10.47,23.22 | R3.1 11.93,31.26 11.79,31.12 11.14,31.12 10.93,30.91 C19.1
  Top 0.508: D2.A 10,23.17 v10.21,22.96 | 10.47,23.22 R7.2 11.19,22.27 R10.1 | v9.58,28.88 v10.13,28.88 v10.14,28.89 U4.4 10.93,28.89 C19.1
  Route15 0.178: v18.74,13.87 16.17,13.87 14.56,15.47 10.21,15.47 | 10.21,15.47 | v13.11,3.53 14.63,3.53 14.75,3.41 v17.16,3.41 | v17.16,3.41
  Route15 0.508: J1.10 3.94,29.21 5.08,30.35 7.96,30.35 9.43,28.88 v9.58,28.88 9.58,25.6 10.21,24.97 v10.21,22.96 v10.21,22.42 10.21,15.47 10.21,11.33 v11.43,10.11 12.55,10.11 13.83,8.83 13.83,6.41 13.12,5.71 v13.12,4.08
  Bottom 0.178: R23.1 17.89,4.46 17.62,4.46 17.16,4 v17.16,3.41
  other vias: 12.54,4.1 12.54,3.52
  pour Top (isolate 0.178, no thermals): 13.24,3.3 9.53,3.3 8.78,4.05 8.78,6.16 14.08,6.16 14.08,4.15
  pour Route15 (isolate 0.305): 13.24,4.2 12.41,4.2 12.41,3.38 13.24,3.38
  pour Route15 (isolate 0.305): 9.39,29.04 10.32,29.04 10.32,28.73 9.39,28.73
  pour Top (isolate 0.305): 11.43,23.43 9.68,23.43 9.68,21.84 11.43,21.84
VIN
  Top 0.178: R8.1 4,27.84 4,26.98 4.41,26.58 U3.1
  Top 0.508: U3.1 5.66,26.58 | 5.66,26.58 5.79,26.58 6.3,26.07 6.3,24.21 MEAS.4 | C7.1 5.65,26.59 5.66,26.58
  Bottom 0.178: MEAS.2 MEAS.4
WS2812-DO
  Top 0.178: J1.9 1.27,31.96 2.61,33.29 4.04,33.29 4.55,32.78 5.64,32.78 6.21,33.34 6.21,35.78 6.8,36.38 8.47,38.05 D5.DO

### Text on the board
Top: 1
Route2: 2
Route15: 3
Bottom: v10 | 4
tPlace: + | -
Measures: Measure Units: INCHES
Reference: 11 | 10 | 12 | 9 | 13 | 8 | 14 | 7 | 15 | 6 | 16 | 5 | 17 | 4 | 18 | 3 | LD | 2 | VU | 1 | EN | 0 | vbat | A0 | G | 3.3V | RESET
tDocu: Soldermask: Red / Thickness: 1.6mm / Four Layer Design / 1oz copper outer / 0.5oz copper inner / Finish: HASL / Stackup: JLC7628 / Material: TG155 | Pete Lewis | Based on designs by: M. Hord, A. Wende